# Altium project VCU.PrjPcb (part 1 of 2)
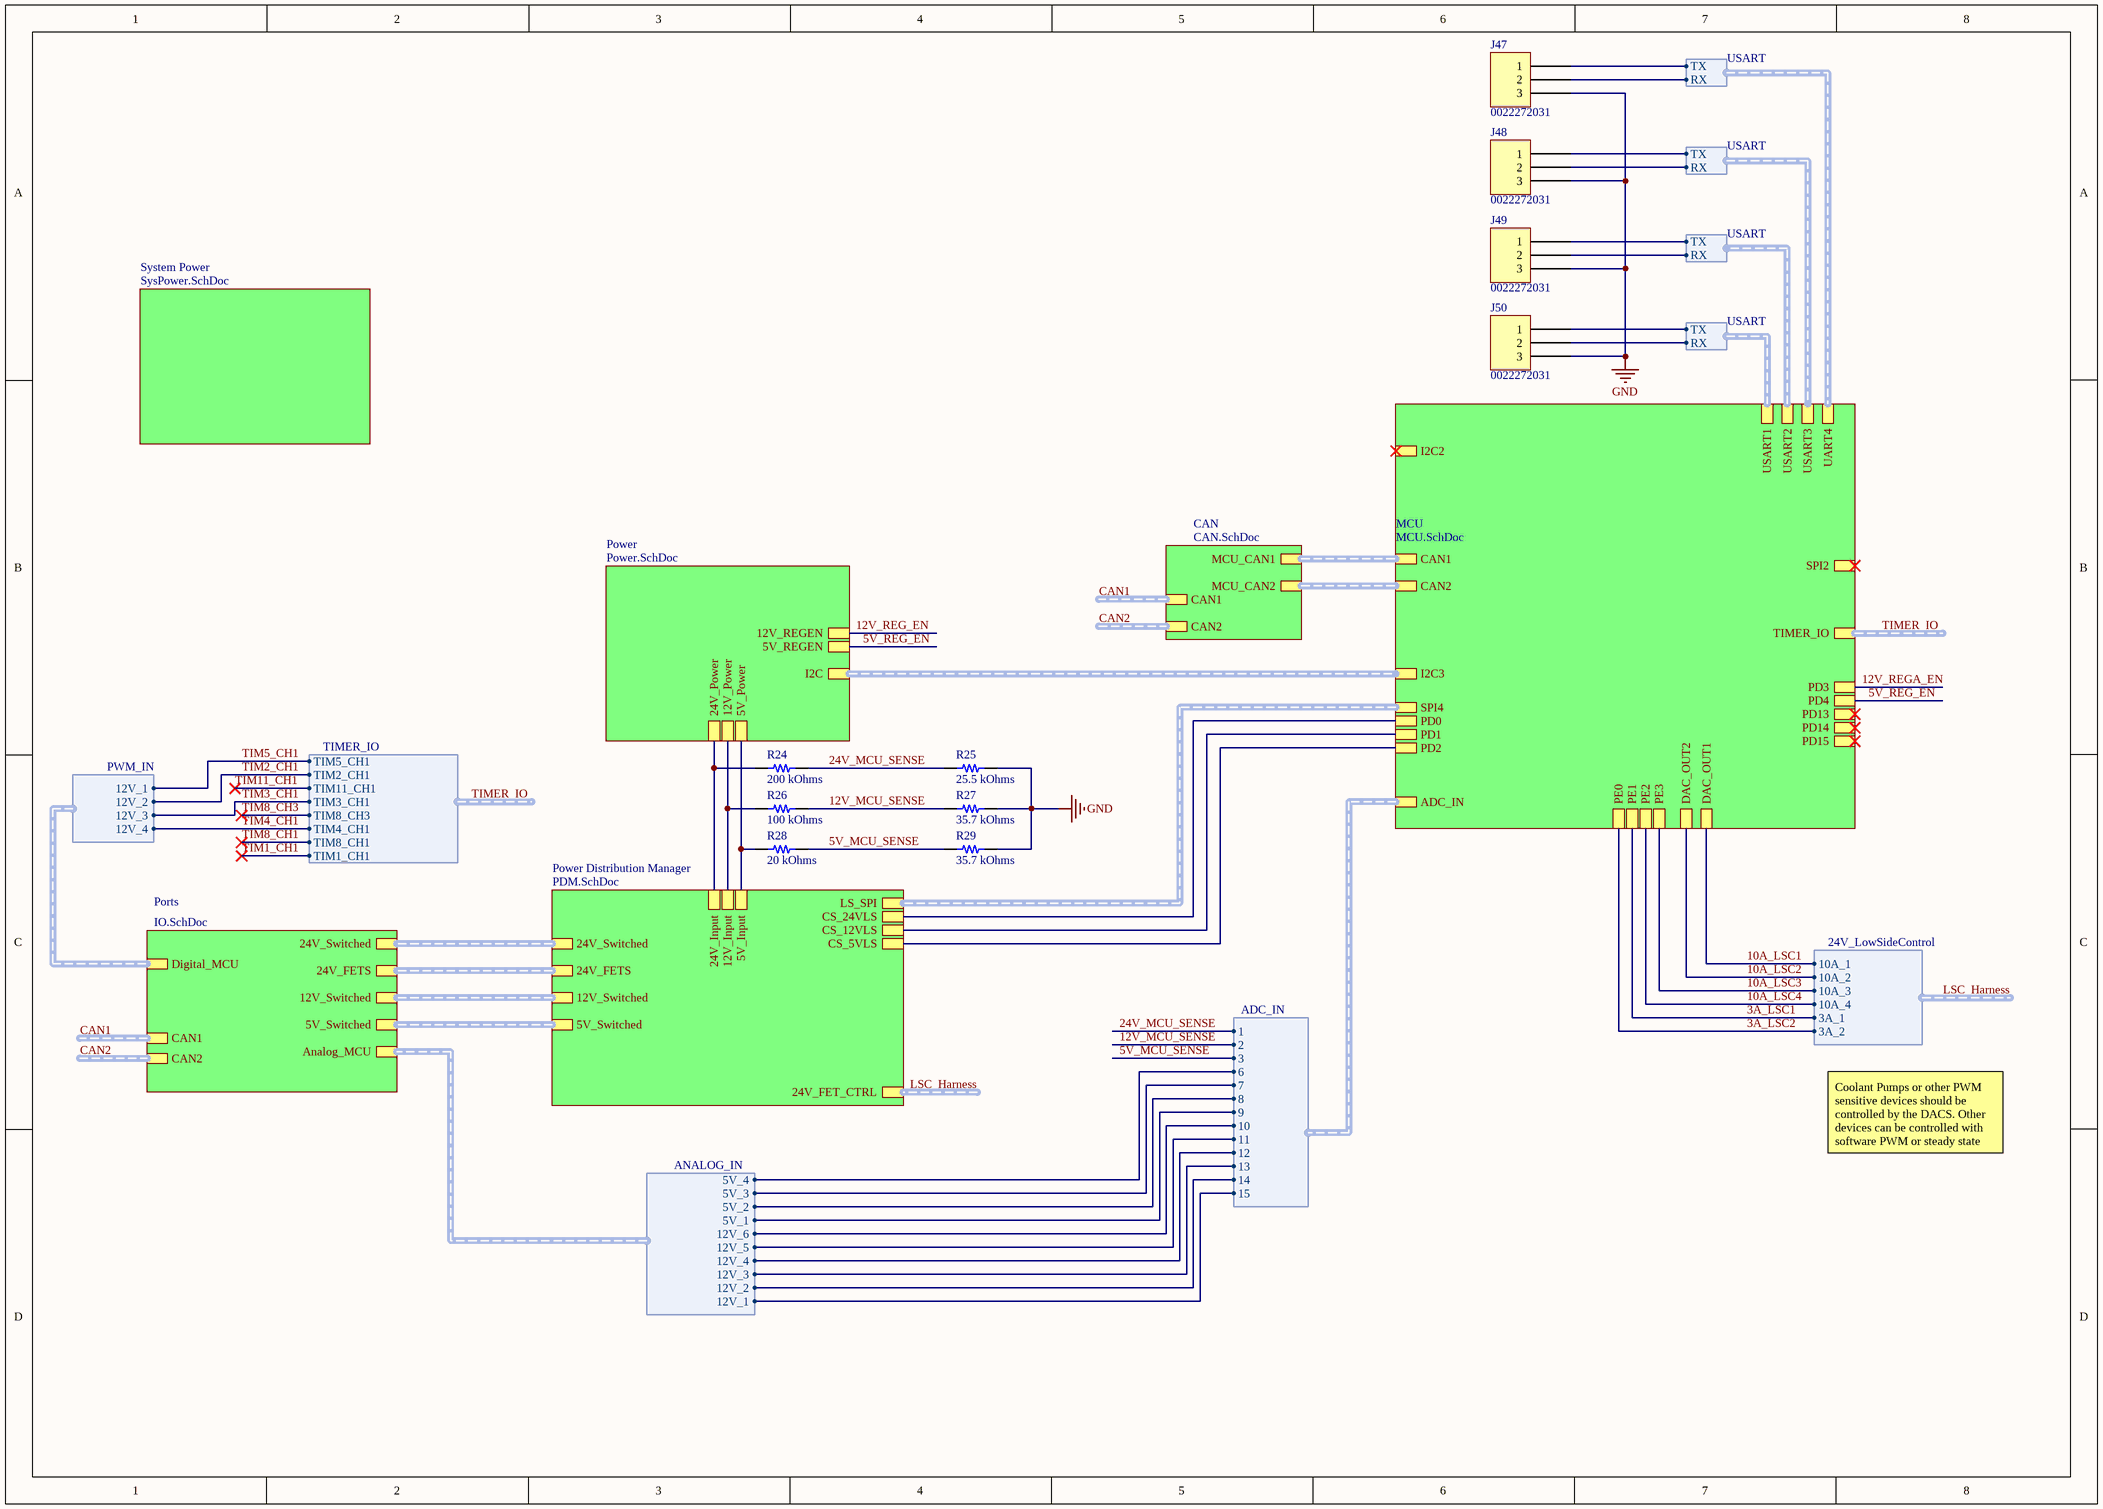
[diagram p0: TOP.SchDoc]
13 sheets, 149 parts. Net scope: hierarchical (ports join the sheet entries above them; power ports are global).
Sheets:
  TOP.SchDoc
    MCU = MCU.SchDoc
    CAN = CAN.SchDoc
    Ports = IO.SchDoc
      Analog Voltage Divs = AnalogIO.SchDoc
        Designator = 12V-3V3_Divider.SchDoc
        Designator = 12V-3V3_Divider.SchDoc
        Designator = 12V-3V3_Divider.SchDoc
        Designator = 12V-3V3_Divider.SchDoc
        Designator = 12V-3V3_Divider.SchDoc
        Designator = 12V-3V3_Divider.SchDoc
        Designator = 5V-3V3_Divider.SchDoc
        Designator = 5V-3V3_Divider.SchDoc
        Designator = 5V-3V3_Divider.SchDoc
        Designator = 5V-3V3_Divider.SchDoc
    Power Distribution Manager = PDM.SchDoc
      24V Load Switches = 24V_Load_Switches.SchDoc
        Designator = ShiftRegister.SchDoc
      Designator = 12V_Load_Switches.SchDoc
        Designator = ShiftRegister.SchDoc
      Designator = 5V_Load_Switches.SchDoc
        Designator = ShiftRegister.SchDoc
      Designator = 24V_FETS.SchDoc

## Sheet TOP.SchDoc: Q24 VCU
size A3; Author: JChisholm; DrawnBy: JChisholm; Organization: Queen's Formula SAE; Address1: 130 Stuart St, Kingston; Address2: Ontario; Address3: Canada; Address4: K7L 2V9; DocumentNumber: 1; Revision: 0; SheetNumber: 1; SheetTotal: 16

### Parts
J47  0022272031  [MOLEX KK 0022272031]
J48  0022272031  [MOLEX KK 0022272031]
J49  0022272031  [MOLEX KK 0022272031]
J50  0022272031  [MOLEX KK 0022272031]
R24  200 kOhms  [RES 0603_1608]
R25  25.5 kOhms  [RES 0603_1608]
R26  100 kOhms  [RES 0603_1608]
R27  35.7 kOhms  [RES 0603_1608]
R28  20 kOhms  [RES 0603_1608]
R29  35.7 kOhms  [RES 0603_1608]

### Sub-sheets
CAN = CAN.SchDoc: MCU_CAN1 (harness MCU_CAN), MCU_CAN2 (harness MCU_CAN), CAN1 (harness CAN), CAN2 (harness CAN)
MCU = MCU.SchDoc: TIMER_IO (harness TIMER_IO), PD0, PD1, PD2, PD3, PD4, ADC_IN (harness ADC_IN), UART4 (harness USART), USART2 (harness USART), SPI2 (harness SPI), USART1 (harness USART), CAN2 (harness MCU_CAN), CAN1 (harness MCU_CAN), USART3 (harness USART), SPI4 (harness SPI), I2C3 (harness I2C), DAC_OUT1, DAC_OUT2, PD13, PD14, PD15, PE0, PE1, PE2, PE3, I2C2 (harness I2C)
Ports = IO.SchDoc: CAN1 (harness CAN), CAN2 (harness CAN), 24V_Switched (harness 24V_LoadSwitches), 12V_Switched (harness 12V_LoadSwitches), 5V_Switched (harness 5V_LoadSwitches), 24V_FETS (harness 24V_FETS), Analog_MCU (harness ANALOG_IN), Digital_MCU (harness PWM_IN)
Power = Power.SchDoc (file not in this document): I2C (harness I2C), 12V_REGEN, 5V_REGEN, 24V_Power, 12V_Power, 5V_Power
Power Distribution Manager = PDM.SchDoc: 24V_Switched (harness 24V_LoadSwitches), 12V_Switched (harness 12V_LoadSwitches), 5V_Switched (harness 5V_LoadSwitches), 24V_FETS (harness 24V_FETS), 24V_FET_CTRL (harness 24V_LowSideControl), CS_24VLS, CS_12VLS, CS_5VLS, LS_SPI (harness SPI), 24V_Input, 12V_Input, 5V_Input
System Power = SysPower.SchDoc (file not in this document): no entries

### Harnesses
TIMER_IO: TIM5_CH1, TIM2_CH1, TIM11_CH1, TIM3_CH1, TIM8_CH3, TIM4_CH1, TIM8_CH1, TIM1_CH1
ANALOG_IN: 12V_1, 12V_2, 12V_3, 12V_4, 12V_5, 12V_6, 5V_1, 5V_2, 5V_3, 5V_4
ADC_IN: 1, 2, 3, 8, 9, 10, 11, 12, 13, 14, 15, 6, 7
24V_LowSideControl: 10A_1, 10A_2, 10A_3, 10A_4, 3A_1, 3A_2
PWM_IN: 12V_1, 12V_2, 12V_3, 12V_4
USART: TX, RX

### Nets
GND: J47.3 J48.3 J49.3 J50.3 R25.2 R27.2 R29.2
3A_LSC1: sheet MCU/PE1, sheet Power Distribution Manager/24V_FET_CTRL.3A_1
3A_LSC2: sheet MCU/PE0, sheet Power Distribution Manager/24V_FET_CTRL.3A_2
5V_MCU_SENSE: R28.2 R29.1 ; sheet MCU/ADC_IN.3
5V_REG_EN: sheet MCU/PD4, sheet Power/5V_REGEN
10A_LSC1: sheet MCU/DAC_OUT1, sheet Power Distribution Manager/24V_FET_CTRL.10A_1
10A_LSC2: sheet MCU/DAC_OUT2, sheet Power Distribution Manager/24V_FET_CTRL.10A_2
10A_LSC3: sheet MCU/PE3, sheet Power Distribution Manager/24V_FET_CTRL.10A_3
10A_LSC4: sheet MCU/PE2, sheet Power Distribution Manager/24V_FET_CTRL.10A_4
12V_MCU_SENSE: R26.2 R27.1 ; sheet MCU/ADC_IN.2
12V_REG_EN: sheet Power/12V_REGEN
24V_MCU_SENSE: R24.2 R25.1 ; sheet MCU/ADC_IN.1
ADC_IN6: sheet Ports/Analog_MCU.5V_4, sheet MCU/ADC_IN.6
ADC_IN7: sheet Ports/Analog_MCU.5V_3, sheet MCU/ADC_IN.7
ADC_IN8: sheet Ports/Analog_MCU.5V_2, sheet MCU/ADC_IN.8
ADC_IN9: sheet Ports/Analog_MCU.5V_1, sheet MCU/ADC_IN.9
ADC_IN10: sheet Ports/Analog_MCU.12V_6, sheet MCU/ADC_IN.10
ADC_IN11: sheet Ports/Analog_MCU.12V_5, sheet MCU/ADC_IN.11
ADC_IN12: sheet Ports/Analog_MCU.12V_4, sheet MCU/ADC_IN.12
ADC_IN13: sheet Ports/Analog_MCU.12V_3, sheet MCU/ADC_IN.13
ADC_IN14: sheet Ports/Analog_MCU.12V_2, sheet MCU/ADC_IN.14
ADC_IN15: sheet Ports/Analog_MCU.12V_1, sheet MCU/ADC_IN.15
TIM2_CH1: sheet MCU/TIMER_IO.TIM2_CH1, sheet Ports/Digital_MCU.12V_2
TIM3_CH1: sheet MCU/TIMER_IO.TIM3_CH1, sheet Ports/Digital_MCU.12V_3
TIM4_CH1: sheet MCU/TIMER_IO.TIM4_CH1, sheet Ports/Digital_MCU.12V_4
TIM5_CH1: sheet MCU/TIMER_IO.TIM5_CH1, sheet Ports/Digital_MCU.12V_1
TIM8_CH1: sheet MCU/TIMER_IO.TIM8_CH1
NetIC1_55: J48.1 ; sheet MCU/USART3.TX
NetIC1_56: J48.2 ; sheet MCU/USART3.RX
NetIC1_68: J50.1 ; sheet MCU/USART1.TX
NetIC1_69: J50.2 ; sheet MCU/USART1.RX
NetIC1_78: J47.1 ; sheet MCU/UART4.TX
NetIC1_79: J47.2 ; sheet MCU/UART4.RX
NetIC1_81: sheet MCU/PD0, sheet Power Distribution Manager/CS_24VLS
NetIC1_82: sheet MCU/PD1, sheet Power Distribution Manager/CS_12VLS
NetIC1_83: sheet MCU/PD2, sheet Power Distribution Manager/CS_5VLS
NetIC1_86: J49.1 ; sheet MCU/USART2.TX
NetIC1_87: J49.2 ; sheet MCU/USART2.RX
NetR24_1: R24.1 ; sheet Power Distribution Manager/24V_Input, sheet Power/24V_Power
NetR26_1: R26.1 ; sheet Power Distribution Manager/12V_Input, sheet Power/12V_Power
NetR28_1: R28.1 ; sheet Power Distribution Manager/5V_Input, sheet Power/5V_Power

### Buses and harness runs
harness CAN1 = sheet CAN/CAN1
harness CAN1 = sheet Ports/CAN1
harness CAN2 = sheet CAN/CAN2
harness CAN2 = sheet Ports/CAN2
harness LSC_Harness = sheet Power Distribution Manager/24V_FET_CTRL
harness sheet CAN/MCU_CAN1 = sheet MCU/CAN1
harness sheet CAN/MCU_CAN2 = sheet MCU/CAN2
harness sheet MCU/I2C3 = sheet Power/I2C
harness sheet MCU/SPI4 = sheet Power Distribution Manager/LS_SPI
harness sheet Ports/5V_Switched = sheet Power Distribution Manager/5V_Switched
harness sheet Ports/12V_Switched = sheet Power Distribution Manager/12V_Switched
harness sheet Ports/24V_FETS = sheet Power Distribution Manager/24V_FETS
harness sheet Ports/24V_Switched = sheet Power Distribution Manager/24V_Switched
harness TIMER_IO = sheet MCU/TIMER_IO

### Notes on the sheet
- Coolant Pumps or other PWM sensitive devices should be controlled by the DACS. Other devices can be controlled with software PWM or steady state
- Title
- Size:
- Date:
- A4
- Number:
- Time:
- Revision:
- Sheet
- of
- File:

### Library data of the parts
J47-J50 = 0022272031: CONN HEADER VERT 3POS 2.54MM; Part Number: 0022272031
R24 = AC0603FR-07200KL: RES SMD 200K OHM 1% 1/10W 0603; Manufacturer: Yageo; Power (Watts): 0.1W, 1/10W; Temperature Coefficient: ±100ppm/°C; Part Number: AC0603FR-07200KL; Value: 200 kOhms; ComponentLink1Description: Datasheet; ComponentLink1URL: https://www.yageo.com/upload/media/product/productsearch/datasheet/rchip/PYu-AC_51_RoHS_L_7.pdf; ComponentLink2Description: DigiKey Link; ComponentLink2URL: https://www.digikey.com/en/products/detail/yageo/AC0603FR-07200KL/5895902; Composition: Thick Film; Device Package: 0603 (1608 Metric); Features: Automotive AEC-Q200, Moisture Resistant; Height - Seated (Max): 0.022" (0.55mm); LastUpdated: 12/20/2023 8:38:29 PM; Lifecycle Status: Active; Minimum Order: 1; Number of Terminations: 2; Operating Temperature: -55°C ~ 155°C; Package / Case: 0603 (1608 Metric); Packaging: CutTape; PartId: 15822; Part Status: Active; Price: 0.01; Ratings: AEC-Q200; Resistance: 200 kOhms; Series: AC; Size / Dimension: 0.063" L x 0.031" W (1.60mm x 0.80mm); Supplier 1: DigiKey; Supplier Part Number 1: YAG3575CT-ND; Supplier Device Package: 0603; Tolerance: ±1%
R25 = CPF0603B25K5E1: RES SMD 25.5KOHM 0.1% 1/16W 0603; Manufacturer: TE Connectivity Passive Product; Power (Watts): 0.063W, 1/16W; Temperature Coefficient: ±25ppm/°C; Part Number: CPF0603B25K5E1; Value: 25.5 kOhms; ComponentLink1Description: Datasheet; ComponentLink1URL: https://www.te.com/commerce/DocumentDelivery/DDEController?Action=srchrtrv&DocNm=1773200&DocType=DS&DocLang=English; ComponentLink2Description: DigiKey Link; ComponentLink2URL: https://www.digikey.com/en/products/detail/te-connectivity-passive-product/CPF0603B25K5E1/2382925; Composition: Thin Film; Device Package: 0603 (1608 Metric); Height - Seated (Max): 0.022" (0.55mm); LastUpdated: 12/20/2023 8:36:34 PM; Lifecycle Status: Active; Minimum Order: 1; Number of Terminations: 2; Operating Temperature: -55°C ~ 155°C; Package / Case: 0603 (1608 Metric); Packaging: TapeAndReel; PartId: 75127; Part Status: Active; Price: 0.12; Resistance: 25.5 kOhms; Series: CPF, Neohm; Size / Dimension: 0.061" L x 0.031" W (1.55mm x 0.80mm); Supplier 1: DigiKey; Supplier Part Number 1: 1712-CPF0603B25K5E1CT-ND; Supplier Device Package: 0603; Tolerance: ±0.1%
R26 = AA0603FR-07100KL: RES SMD 100K OHM 1% 1/10W 0603; Manufacturer: Yageo; Power (Watts): 0.1W, 1/10W; Temperature Coefficient: ±150ppm/°C; Part Number: AA0603FR-07100KL; Value: 100 kOhms; ComponentLink1Description: Datasheet; ComponentLink1URL: https://www.yageo.com/upload/media/product/productsearch/datasheet/rchip/PYu-AA_51_RoHS_L_3.pdf; ComponentLink2Description: DigiKey Link; ComponentLink2URL: https://www.digikey.com/en/products/detail/yageo/AA0603FR-07100KL/5888687; Composition: Thick Film; Device Package: 0603 (1608 Metric); Features: Anti-Sulfur, Automotive AEC-Q200, Moisture Resistant; Height - Seated (Max): 0.022" (0.55mm); LastUpdated: 12/20/2023 8:36:28 PM; Lifecycle Status: Active; Minimum Order: 1; Number of Terminations: 2; Operating Temperature: -55°C ~ 155°C; Package / Case: 0603 (1608 Metric); Packaging: TapeAndReel; PartId: 78895; Price: 0.01; Ratings: AEC-Q200; Resistance: 100 kOhms; Series: AA; Size / Dimension: 0.063" L x 0.031" W (1.60mm x 0.80mm); Supplier 1: DigiKey; Supplier Part Number 1: 13-AA0603FR-07100KLCT-ND; Supplier Device Package: 0603; Tolerance: ±1%
R27 R29 = RT0603BRD0735K7L: RES SMD 35.7KOHM 0.1% 1/10W 0603; Manufacturer: Yageo; Power (Watts): 0.1W, 1/10W; Temperature Coefficient: ±25ppm/°C; Part Number: RT0603BRD0735K7L; Value: 35.7 kOhms; ComponentLink1Description: Datasheet; ComponentLink1URL: https://www.yageo.com/upload/media/product/productsearch/datasheet/rchip/PYu-RT_1-to-0.01_RoHS_L_11.pdf; ComponentLink2Description: DigiKey Link; ComponentLink2URL: https://www.digikey.com/en/products/detail/yageo/RT0603BRD0735K7L/1072480; Composition: Thin Film; Device Package: 0603 (1608 Metric); Height - Seated (Max): 0.022" (0.55mm); LastUpdated: 12/20/2023 8:38:52 PM; Lifecycle Status: Active; Minimum Order: 1; Number of Terminations: 2; Operating Temperature: -55°C ~ 155°C; Package / Case: 0603 (1608 Metric); Packaging: TapeAndReel; PartId: 9286; Part Status: Active; Price: 0.03; Resistance: 35.7 kOhms; Series: RT; Size / Dimension: 0.063" L x 0.031" W (1.60mm x 0.80mm); Supplier 1: DigiKey; Supplier Part Number 1: YAG1642CT-ND; Supplier Device Package: 0603; Tolerance: ±0.1%
R28 = AC0603FR-0720KL: RES SMD 20K OHM 1% 1/10W 0603; Manufacturer: Yageo; Power (Watts): 0.1W, 1/10W; Temperature Coefficient: ±100ppm/°C; Part Number: AC0603FR-0720KL; Value: 20 kOhms; ComponentLink1Description: Datasheet; ComponentLink1URL: https://www.yageo.com/upload/media/product/productsearch/datasheet/rchip/PYu-AC_51_RoHS_L_7.pdf; ComponentLink2Description: DigiKey Link; ComponentLink2URL: https://www.digikey.com/en/products/detail/yageo/AC0603FR-0720KL/5895907; Composition: Thick Film; Device Package: 0603 (1608 Metric); Features: Automotive AEC-Q200, Moisture Resistant; Height - Seated (Max): 0.022" (0.55mm); LastUpdated: 12/20/2023 8:38:24 PM; Lifecycle Status: Active; Minimum Order: 1; Number of Terminations: 2; Operating Temperature: -55°C ~ 155°C; Package / Case: 0603 (1608 Metric); Packaging: CutTape; PartId: 17364; Part Status: Active; Price: 0.01; Ratings: AEC-Q200; Resistance: 20 kOhms; Series: AC; Size / Dimension: 0.063" L x 0.031" W (1.60mm x 0.80mm); Supplier 1: DigiKey; Supplier Part Number 1: YAG3577CT-ND; Supplier Device Package: 0603; Tolerance: ±1%

## Sheet MCU.SchDoc: =DocumentName
size A3; Organization: Queen's Formula SAE; Address1: 130 Stuart St, Kingston; Address2: Ontario; Address3: Canada; Address4: K7L 2V9; DocumentNumber: 1; Revision: 0; SheetNumber: 2; SheetTotal: 19
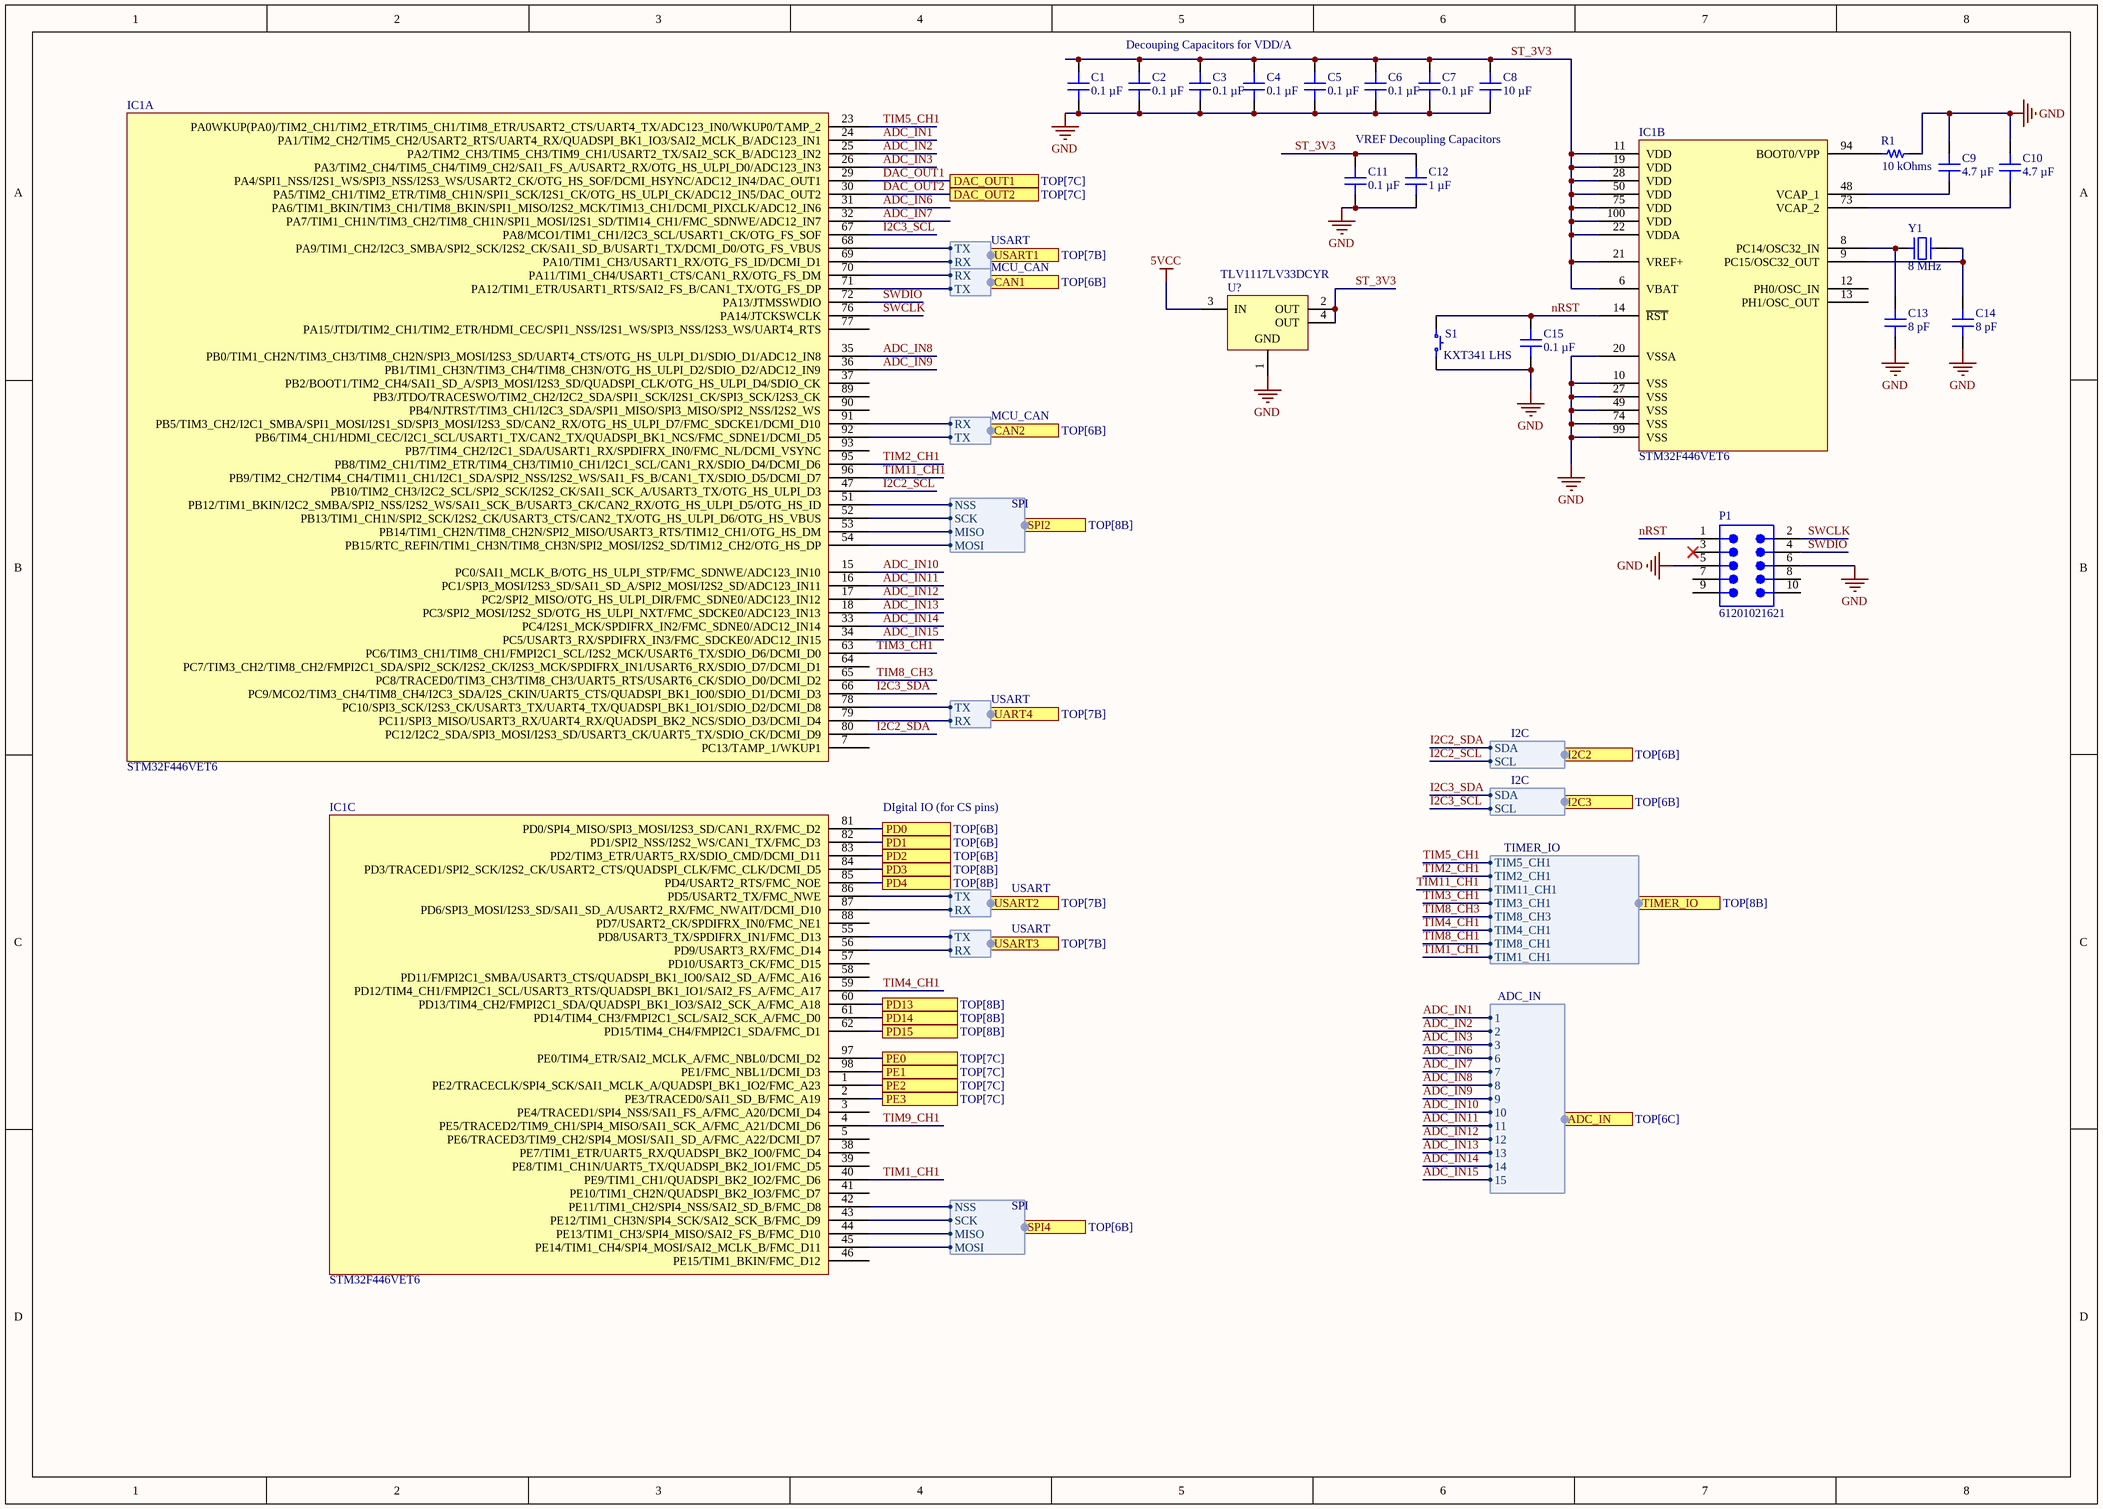
[diagram p1: MCU.SchDoc]

### Parts
(Parts that share a designator on the sheet are numbered #1, #2 ... from top to bottom, then left to right.)
C1  0.1 µF  [CAP 0603_1608]
C2  0.1 µF  [CAP 0603_1608]
C3  0.1 µF  [CAP 0603_1608]
C4  0.1 µF  [CAP 0603_1608]
C5  0.1 µF  [CAP 0603_1608]
C6  0.1 µF  [CAP 0603_1608]
C7  0.1 µF  [CAP 0603_1608]
C8  10 µF  [CAP 0603_1608]
C9  4.7 µF  [CAP 0603_1608]
C10  4.7 µF  [CAP 0603_1608]
C11  0.1 µF  [CAP 0603_1608]
C12  1 µF  [CAP 0603_1608]
C13  8 pF  [CAP 0603_1608]
C14  8 pF  [CAP 0603_1608]
C15  0.1 µF  [CAP 0603_1608]
IC1  STM32F446VET6  [ST LQFP-100 14X14MM]  (parts A,B,C of 3)
P1  61201021621  [61201021621]
R1  10 kOhms  [RES 0603_1608]
S1  KXT341 LHS  [C&K KXT3]
U?#1  TLV1117LV33DCYR  [DCY0004A_N]
Y1  8 MHz  [ABRACON ABLS]

### Ports
ADC_IN (harness ADC_IN, see TOP[6C]), CAN1 (harness MCU_CAN, see TOP[6B]), CAN2 (harness MCU_CAN, see TOP[6B]), DAC_OUT1 (see TOP[7C]), DAC_OUT2 (see TOP[7C]), I2C2 (harness I2C, see TOP[6B]), I2C3 (harness I2C, see TOP[6B]), PD0 (see TOP[6B]), PD1 (see TOP[6B]), PD2 (see TOP[6B]), PD3 (see TOP[8B]), PD4 (see TOP[8B]), PD13 (see TOP[8B]), PD14 (see TOP[8B]), PD15 (see TOP[8B]), PE0 (see TOP[7C]), PE1 (see TOP[7C]), PE2 (see TOP[7C]), PE3 (see TOP[7C]), SPI2 (harness SPI, see TOP[8B]), SPI4 (harness SPI, see TOP[6B]), TIMER_IO (harness TIMER_IO, see TOP[8B]), UART4 (harness USART, see TOP[7B]), USART1 (harness USART, see TOP[7B]), USART2 (harness USART, see TOP[7B]), USART3 (harness USART, see TOP[7B])

### Harnesses
USART: TX, RX
SPI: NSS, SCK, MISO, MOSI
MCU_CAN: TX, RX
TIMER_IO: TIM5_CH1, TIM2_CH1, TIM11_CH1, TIM3_CH1, TIM8_CH3, TIM4_CH1, TIM8_CH1, TIM1_CH1
I2C: SDA, SCL
ADC_IN: 1, 2, 3, 8, 9, 10, 11, 12, 13, 14, 15, 6, 7

### Nets
5VCC: U?#1.3(IN)
GND: C1.1 C2.1 C3.1 C4.1 C5.1 C6.1 C7.1 C8.1 C9.2 C10.2 C11.1 C12.1 C13.1 C14.1 C15.1 IC1.10(VSS) IC1.20(VSSA) IC1.27(VSS) IC1.49(VSS) IC1.74(VSS) IC1.99(VSS) P1.5 P1.6 R1.2 S1.2 U?#1.1(GND)
3A_LSC1: IC1.98(PE1/FMC_NBL1/DCMI_D3) ; port PE1
3A_LSC2: IC1.97(PE0/TIM4_ETR/SAI2_MCLK_A/FMC_NBL0/DCMI_D2) ; port PE0
5V_REG_EN: IC1.85(PD4/USART2_RTS/FMC_NOE) ; port PD4
10A_LSC3: IC1.2(PE3/TRACED0/SAI1_SD_B/FMC_A19) ; port PE3
10A_LSC4: IC1.1(PE2/TRACECLK/SPI4_SCK/SAI1_MCLK_A/QUADSPI_BK1_IO2/FMC_A23) ; port PE2
12V_REGA_EN: IC1.84(PD3/TRACED1/SPI2_SCK/I2S2_CK/USART2_CTS/QUADSPI_CLK/FMC_CLK/DCMI_D5) ; port PD3
ADC_IN1: IC1.24(PA1/TIM2_CH2/TIM5_CH2/USART2_RTS/UART4_RX/QUADSPI_BK1_IO3/SAI2_MCLK_B/ADC123_IN1) ; port ADC_IN.1  [project net 24V_MCU_SENSE]
ADC_IN2: IC1.25(PA2/TIM2_CH3/TIM5_CH3/TIM9_CH1/USART2_TX/SAI2_SCK_B/ADC123_IN2) ; port ADC_IN.2  [project net 12V_MCU_SENSE]
ADC_IN3: IC1.26(PA3/TIM2_CH4/TIM5_CH4/TIM9_CH2/SAI1_FS_A/USART2_RX/OTG_HS_ULPI_D0/ADC123_IN3) ; port ADC_IN.3  [project net 5V_MCU_SENSE]
ADC_IN6: IC1.31(PA6/TIM1_BKIN/TIM3_CH1/TIM8_BKIN/SPI1_MISO/I2S2_MCK/TIM13_CH1/DCMI_PIXCLK/ADC12_IN6) ; port ADC_IN.6
ADC_IN7: IC1.32(PA7/TIM1_CH1N/TIM3_CH2/TIM8_CH1N/SPI1_MOSI/I2S1_SD/TIM14_CH1/FMC_SDNWE/ADC12_IN7) ; port ADC_IN.7
ADC_IN8: IC1.35(PB0/TIM1_CH2N/TIM3_CH3/TIM8_CH2N/SPI3_MOSI/I2S3_SD/UART4_CTS/OTG_HS_ULPI_D1/SDIO_D1/ADC12_IN8) ; port ADC_IN.8
ADC_IN9: IC1.36(PB1/TIM1_CH3N/TIM3_CH4/TIM8_CH3N/OTG_HS_ULPI_D2/SDIO_D2/ADC12_IN9) ; port ADC_IN.9
ADC_IN10: IC1.15(PC0/SAI1_MCLK_B/OTG_HS_ULPI_STP/FMC_SDNWE/ADC123_IN10) ; port ADC_IN.10
ADC_IN11: IC1.16(PC1/SPI3_MOSI/I2S3_SD/SAI1_SD_A/SPI2_MOSI/I2S2_SD/ADC123_IN11) ; port ADC_IN.11
ADC_IN12: IC1.17(PC2/SPI2_MISO/OTG_HS_ULPI_DIR/FMC_SDNE0/ADC123_IN12) ; port ADC_IN.12
ADC_IN13: IC1.18(PC3/SPI2_MOSI/I2S2_SD/OTG_HS_ULPI_NXT/FMC_SDCKE0/ADC123_IN13) ; port ADC_IN.13
ADC_IN14: IC1.33(PC4/I2S1_MCK/SPDIFRX_IN2/FMC_SDNE0/ADC12_IN14) ; port ADC_IN.14
ADC_IN15: IC1.34(PC5/USART3_RX/SPDIFRX_IN3/FMC_SDCKE0/ADC12_IN15) ; port ADC_IN.15
DAC_OUT1: IC1.29(PA4/SPI1_NSS/I2S1_WS/SPI3_NSS/I2S3_WS/USART2_CK/OTG_HS_SOF/DCMI_HSYNC/ADC12_IN4/DAC_OUT1) ; port DAC_OUT1  [project net 10A_LSC1]
DAC_OUT2: IC1.30(PA5/TIM2_CH1/TIM2_ETR/TIM8_CH1N/SPI1_SCK/I2S1_CK/OTG_HS_ULPI_CK/ADC12_IN5/DAC_OUT2) ; port DAC_OUT2  [project net 10A_LSC2]
I2C2_SCL: IC1.47(PB10/TIM2_CH3/I2C2_SCL/SPI2_SCK/I2S2_CK/SAI1_SCK_A/USART3_TX/OTG_HS_ULPI_D3) ; port I2C2.SCL
I2C2_SDA: IC1.80(PC12/I2C2_SDA/SPI3_MOSI/I2S3_SD/USART3_CK/UART5_TX/SDIO_CK/DCMI_D9) ; port I2C2.SDA
I2C3_SCL: IC1.67(PA8/MCO1/TIM1_CH1/I2C3_SCL/USART1_CK/OTG_FS_SOF) ; port I2C3.SCL
I2C3_SDA: IC1.66(PC9/MCO2/TIM3_CH4/TIM8_CH4/I2C3_SDA/I2S_CKIN/UART5_CTS/QUADSPI_BK1_IO0/SDIO_D1/DCMI_D3) ; port I2C3.SDA
nRST: C15.2 IC1.14(~{RST}) P1.1 S1.1
ST_3V3: C1.2 C2.2 C3.2 C4.2 C5.2 C6.2 C7.2 C8.2 C11.2 C12.2 IC1.6(VBAT) IC1.11(VDD) IC1.19(VDD) IC1.21(VREF+) IC1.22(VDDA) IC1.28(VDD) IC1.50(VDD) IC1.75(VDD) IC1.100(VDD) U?#1.2(OUT) U?#1.4(OUT)
SWCLK: IC1.76(PA14/JTCKSWCLK) P1.2
SWDIO: IC1.72(PA13/JTMSSWDIO) P1.4
TIM1_CH1: IC1.40(PE9/TIM1_CH1/QUADSPI_BK2_IO2/FMC_D6) ; port TIMER_IO.TIM1_CH1
TIM2_CH1: IC1.95(PB8/TIM2_CH1/TIM2_ETR/TIM4_CH3/TIM10_CH1/I2C1_SCL/CAN1_RX/SDIO_D4/DCMI_D6) ; port TIMER_IO.TIM2_CH1
TIM3_CH1: IC1.63(PC6/TIM3_CH1/TIM8_CH1/FMPI2C1_SCL/I2S2_MCK/USART6_TX/SDIO_D6/DCMI_D0) ; port TIMER_IO.TIM3_CH1
TIM4_CH1: IC1.59(PD12/TIM4_CH1/FMPI2C1_SCL/USART3_RTS/QUADSPI_BK1_IO1/SAI2_FS_A/FMC_A17) ; port TIMER_IO.TIM4_CH1
TIM5_CH1: IC1.23(PA0WKUP(PA0)/TIM2_CH1/TIM2_ETR/TIM5_CH1/TIM8_ETR/USART2_CTS/UART4_TX/ADC123_IN0/WKUP0/TAMP_2) ; port TIMER_IO.TIM5_CH1
TIM8_CH1: port TIMER_IO.TIM8_CH1
TIM8_CH3: IC1.65(PC8/TRACED0/TIM3_CH3/TIM8_CH3/UART5_RTS/USART6_CK/SDIO_D0/DCMI_D2) ; port TIMER_IO.TIM8_CH3
TIM9_CH1: IC1.4(PE5/TRACED2/TIM9_CH1/SPI4_MISO/SAI1_SCK_A/FMC_A21/DCMI_D6)
TIM11_CH1: IC1.96(PB9/TIM2_CH2/TIM4_CH4/TIM11_CH1/I2C1_SDA/SPI2_NSS/I2S2_WS/SAI1_FS_B/CAN1_TX/SDIO_D5/DCMI_D7) ; port TIMER_IO.TIM11_CH1
NetC9_1: C9.1 IC1.48(VCAP_1)
NetC10_1: C10.1 IC1.73(VCAP_2)
NetC13_2: C13.2 IC1.8(PC14/OSC32_IN) Y1.2
NetC14_2: C14.2 IC1.9(PC15/OSC32_OUT) Y1.1
NetIC1_42: IC1.42(PE11/TIM1_CH2/SPI4_NSS/SAI2_SD_B/FMC_D8) ; port SPI4.NSS
NetIC1_43: IC1.43(PE12/TIM1_CH3N/SPI4_SCK/SAI2_SCK_B/FMC_D9) ; port SPI4.SCK
NetIC1_44: IC1.44(PE13/TIM1_CH3/SPI4_MISO/SAI2_FS_B/FMC_D10) ; port SPI4.MISO
NetIC1_45: IC1.45(PE14/TIM1_CH4/SPI4_MOSI/SAI2_MCLK_B/FMC_D11) ; port SPI4.MOSI
NetIC1_51: IC1.51(PB12/TIM1_BKIN/I2C2_SMBA/SPI2_NSS/I2S2_WS/SAI1_SCK_B/USART3_CK/CAN2_RX/OTG_HS_ULPI_D5/OTG_HS_ID) ; port SPI2.NSS
NetIC1_52: IC1.52(PB13/TIM1_CH1N/SPI2_SCK/I2S2_CK/USART3_CTS/CAN2_TX/OTG_HS_ULPI_D6/OTG_HS_VBUS) ; port SPI2.SCK
NetIC1_53: IC1.53(PB14/TIM1_CH2N/TIM8_CH2N/SPI2_MISO/USART3_RTS/TIM12_CH1/OTG_HS_DM) ; port SPI2.MISO
NetIC1_54: IC1.54(PB15/RTC_REFIN/TIM1_CH3N/TIM8_CH3N/SPI2_MOSI/I2S2_SD/TIM12_CH2/OTG_HS_DP) ; port SPI2.MOSI
NetIC1_55: IC1.55(PD8/USART3_TX/SPDIFRX_IN1/FMC_D13) ; port USART3.TX
NetIC1_56: IC1.56(PD9/USART3_RX/FMC_D14) ; port USART3.RX
NetIC1_60: IC1.60(PD13/TIM4_CH2/FMPI2C1_SDA/QUADSPI_BK1_IO3/SAI2_SCK_A/FMC_A18) ; port PD13
NetIC1_61: IC1.61(PD14/TIM4_CH3/FMPI2C1_SCL/SAI2_SCK_A/FMC_D0) ; port PD14
NetIC1_62: IC1.62(PD15/TIM4_CH4/FMPI2C1_SDA/FMC_D1) ; port PD15
NetIC1_68: IC1.68(PA9/TIM1_CH2/I2C3_SMBA/SPI2_SCK/I2S2_CK/SAI1_SD_B/USART1_TX/DCMI_D0/OTG_FS_VBUS) ; port USART1.TX
NetIC1_69: IC1.69(PA10/TIM1_CH3/USART1_RX/OTG_FS_ID/DCMI_D1) ; port USART1.RX
NetIC1_70: IC1.70(PA11/TIM1_CH4/USART1_CTS/CAN1_RX/OTG_FS_DM) ; port CAN1.RX
NetIC1_71: IC1.71(PA12/TIM1_ETR/USART1_RTS/SAI2_FS_B/CAN1_TX/OTG_FS_DP) ; port CAN1.TX
NetIC1_78: IC1.78(PC10/SPI3_SCK/I2S3_CK/USART3_TX/UART4_TX/QUADSPI_BK1_IO1/SDIO_D2/DCMI_D8) ; port UART4.TX
NetIC1_79: IC1.79(PC11/SPI3_MISO/USART3_RX/UART4_RX/QUADSPI_BK2_NCS/SDIO_D3/DCMI_D4) ; port UART4.RX
NetIC1_81: IC1.81(PD0/SPI4_MISO/SPI3_MOSI/I2S3_SD/CAN1_RX/FMC_D2) ; port PD0
NetIC1_82: IC1.82(PD1/SPI2_NSS/I2S2_WS/CAN1_TX/FMC_D3) ; port PD1
NetIC1_83: IC1.83(PD2/TIM3_ETR/UART5_RX/SDIO_CMD/DCMI_D11) ; port PD2
NetIC1_86: IC1.86(PD5/USART2_TX/FMC_NWE) ; port USART2.TX
NetIC1_87: IC1.87(PD6/SPI3_MOSI/I2S3_SD/SAI1_SD_A/USART2_RX/FMC_NWAIT/DCMI_D10) ; port USART2.RX
NetIC1_91: IC1.91(PB5/TIM3_CH2/I2C1_SMBA/SPI1_MOSI/I2S1_SD/SPI3_MOSI/I2S3_SD/CAN2_RX/OTG_HS_ULPI_D7/FMC_SDCKE1/DCMI_D10) ; port CAN2.RX
NetIC1_92: IC1.92(PB6/TIM4_CH1/HDMI_CEC/I2C1_SCL/USART1_TX/CAN2_TX/QUADSPI_BK1_NCS/FMC_SDNE1/DCMI_D5) ; port CAN2.TX
NetIC1_94: IC1.94(BOOT0/VPP) R1.1

Not connected (* = marked no-connect by the designer): IC1 3(PE4/TRACED1/SPI4_NSS/SAI1_FS_A/FMC_A20/DCMI_D4) 5(PE6/TRACED3/TIM9_CH2/SPI4_MOSI/SAI1_SD_A/FMC_A22/DCMI_D7) 7(PC13/TAMP_1/WKUP1) 12(PH0/OSC_IN) 13(PH1/OSC_OUT) 37(PB2/BOOT1/TIM2_CH4/SAI1_SD_A/SPI3_MOSI/I2S3_SD/QUADSPI_CLK/OTG_HS_ULPI_D4/SDIO_CK) 38(PE7/TIM1_ETR/UART5_RX/QUADSPI_BK2_IO0/FMC_D4) 39(PE8/TIM1_CH1N/UART5_TX/QUADSPI_BK2_IO1/FMC_D5) 41(PE10/TIM1_CH2N/QUADSPI_BK2_IO3/FMC_D7) 46(PE15/TIM1_BKIN/FMC_D12) 57(PD10/USART3_CK/FMC_D15) 58(PD11/FMPI2C1_SMBA/USART3_CTS/QUADSPI_BK1_IO0/SAI2_SD_A/FMC_A16) 64(PC7/TIM3_CH2/TIM8_CH2/FMPI2C1_SDA/SPI2_SCK/I2S2_CK/I2S3_MCK/SPDIFRX_IN1/USART6_RX/SDIO_D7/DCMI_D1) 77(PA15/JTDI/TIM2_CH1/TIM2_ETR/HDMI_CEC/SPI1_NSS/I2S1_WS/SPI3_NSS/I2S3_WS/UART4_RTS) 88(PD7/USART2_CK/SPDIFRX_IN0/FMC_NE1) 89(PB3/JTDO/TRACESWO/TIM2_CH2/I2C2_SDA/SPI1_SCK/I2S1_CK/SPI3_SCK/I2S3_CK) 90(PB4/NJTRST/TIM3_CH1/I2C3_SDA/SPI1_MISO/SPI3_MISO/SPI2_NSS/I2S2_WS) 93(PB7/TIM4_CH2/I2C1_SDA/USART1_RX/SPDIFRX_IN0/FMC_NL/DCMI_VSYNC); P1 3* 7 8 9 10

### Notes on the sheet
- Decouping Capacitors for VDD/A
- VREF Decoupling Capacitors
- DIgital IO (for CS pins)
- Title
- Size:
- Date:
- A4
- Number:
- Time:
- Revision:
- Sheet
- of
- File:

### Library data of the parts
C1-C7 C11 C15 = GMC10X7R104K25NT: CAP0603 X7R .1UF 10% 25V; manufacturer: Cal-Chip Electronics, Inc.; Part Number: GMC10X7R104K25NT; Value: 0.1 µF; Applications: General Purpose; Capacitance: 0.1 µF; componentlink1description: Datasheet; componentlink1url: https://88ce57.p3cdn1.secureserver.net/wp-content/uploads/2023/01/gmc_series-2.pdf; componentlink2description: DigiKey Link; componentlink2url: https://www.digikey.com/en/products/detail/cal-chip-electronics-inc/GMC10X7R104K25NT/19910724; Device Package: 0603 (1608 Metric); lastupdated: 12/17/2023 8:07:44 PM; Lifecycle Status: Active; Minimum Order: 1; Mounting Type: Surface Mount, MLCC; Operating Temperature: -55°C ~ 125°C; Package / Case: 0603 (1608 Metric); packaging: TapeAndReel; partid: 56631; price: 0.01; series: GMC; Size / Dimension: 0.063" L x 0.031" W (1.60mm x 0.80mm); Supplier 1: DigiKey; Supplier Part Number 1: 4713-GMC10X7R104K25NTCT-ND; Temperature Coefficient: X7R; Thickness (Max): 0.035" (0.90mm); Tolerance: ±10%; Voltage - Rated: 25V
C8 = CM105X5R106K16AT: 0603 X5R 10UF10% 16V; manufacturer: KYOCERA AVX; Tolerance: ±10%; Part Number: CM105X5R106K16AT; Value: 10 µF; Applications: General Purpose; Capacitance: 10 µF; componentlink1description: Datasheet; componentlink1url: https://ele.kyocera.com/assets/products/capacitor/CM_Series_e.pdf; componentlink2description: DigiKey Link; componentlink2url: https://www.digikey.com/en/products/detail/kyocera-avx/CM105X5R106K16AT/17866311; Device Package: 0603 (1608 Metric); lastupdated: 12/17/2023 8:07:58 PM; Lifecycle Status: Active; Minimum Order: 1; Mounting Type: Surface Mount, MLCC; Operating Temperature: -55°C ~ 85°C; Package / Case: 0603 (1608 Metric); packaging: TapeAndReel; partid: 55416; Part Status: Active; price: 0.03; series: CM; Size / Dimension: 0.063" L x 0.031" W (1.60mm x 0.80mm); Supplier 1: DigiKey; Supplier Part Number 1: 478-CM105X5R106K16ATCT-ND; Temperature Coefficient: X5R; Thickness (Max): 0.039" (1.00mm); Voltage - Rated: 16V
C9 C10 = CM105X6S475K16AT: 0603 X6S 4.7UF10% 16V; manufacturer: KYOCERA AVX; Tolerance: ±10%; Part Number: CM105X6S475K16AT; Value: 4.7 µF; Applications: General Purpose; Capacitance: 4.7 µF; componentlink1description: Datasheet; componentlink1url: https://ele.kyocera.com/assets/products/capacitor/CM_Series_e.pdf; componentlink2description: DigiKey Link; componentlink2url: https://www.digikey.com/en/products/detail/kyocera-avx/CM105X6S475K16AT/17866329; Device Package: 0603 (1608 Metric); lastupdated: 12/17/2023 8:08:01 PM; Lifecycle Status: Active; Minimum Order: 1; Mounting Type: Surface Mount, MLCC; Operating Temperature: -55°C ~ 105°C; Package / Case: 0603 (1608 Metric); packaging: TapeAndReel; partid: 54723; Part Status: Active; price: 0.06; series: CM; Size / Dimension: 0.063" L x 0.031" W (1.60mm x 0.80mm); Supplier 1: DigiKey; Supplier Part Number 1: 478-CM105X6S475K16ATCT-ND; Temperature Coefficient: X6S; Thickness (Max): 0.039" (1.00mm); Voltage - Rated: 16V
C12 = GMC10X7R105K50NT: CAP0603 X7R 1UF 10% 50V; manufacturer: Cal-Chip Electronics, Inc.; Part Number: GMC10X7R105K50NT; Value: 1 µF; Applications: General Purpose; Capacitance: 1 µF; componentlink1description: Datasheet; componentlink1url: https://88ce57.p3cdn1.secureserver.net/wp-content/uploads/2023/01/gmc_series-2.pdf; componentlink2description: DigiKey Link; componentlink2url: https://www.digikey.com/en/products/detail/cal-chip-electronics-inc/GMC10X7R105K50NT/18151141; Device Package: 0603 (1608 Metric); lastupdated: 12/17/2023 8:08:42 PM; Lifecycle Status: Active; Minimum Order: 1; Mounting Type: Surface Mount, MLCC; Operating Temperature: -55°C ~ 125°C; Package / Case: 0603 (1608 Metric); packaging: TapeAndReel; partid: 49828; Part Status: Active; price: 0.03; series: GMC; Size / Dimension: 0.063" L x 0.031" W (1.60mm x 0.80mm); Supplier 1: DigiKey; Supplier Part Number 1: 4713-GMC10X7R105K50NTCT-ND; Temperature Coefficient: X7R; Thickness (Max): 0.037" (0.95mm); Tolerance: ±10%; Voltage - Rated: 50V
C13 C14 = CGA3E2C0G1H080D080AA: CAP CER 8PF 50V C0G 0603; manufacturer: TDK Corporation; Temperature Coefficient: C0G, NP0; Tolerance: ±0.5pF; Part Number: CGA3E2C0G1H080D080AA; Value: 8 pF; Applications: Automotive; Capacitance: 8 pF; componentlink1description: Datasheet; componentlink1url: https://product.tdk.com/info/en/catalog/datasheets/mlcc_automotive_general_en.pdf?ref_disty=digikey; componentlink2description: DigiKey Link; componentlink2url: https://www.digikey.com/en/products/detail/tdk-corporation/CGA3E2C0G1H080D080AA/2443104; Device Package: 0603 (1608 Metric); lastupdated: 12/17/2023 8:09:16 PM; Lifecycle Status: Active; Minimum Order: 1; Mounting Type: Surface Mount, MLCC; Operating Temperature: -55°C ~ 125°C; Package / Case: 0603 (1608 Metric); packaging: TapeAndReel; partid: 15270; Part Status: Active; price: 0.01; Ratings: AEC-Q200; series: CGA; Size / Dimension: 0.063" L x 0.031" W (1.60mm x 0.80mm); Supplier 1: DigiKey; Supplier Part Number 1: 445-5626-1-ND; Thickness (Max): 0.035" (0.90mm); Voltage - Rated: 50V
IC1 = STM32F446VET6: IC MCU 32BIT 512KB FLASH 100LQFP; Manufacturer: STMicroelectronics; Connectivity: CANbus, EBI/EMI, I²C, IrDA, LINbus, SAI, SD, SPDIF-Rx, SPI, UART/USART, USB, USB OTG; Core Processor: ARM® Cortex®-M4; Core Size: 32-Bit; Data Converters: A/D 16x12b; D/A 2x12b; Number of I/O: 81; Oscillator Type: Internal; Peripherals: Brown-out Detect/Reset, DMA, I²S, LVD, POR, PWM, WDT; Program Memory Size: 512KB (512K x 8); RAM Size: 128K x 8; Speed: 180MHz; Voltage - Supply (Vcc/Vdd): 1.7V ~ 3.6V; Part Number: STM32F446VET6; ComponentLink1Description: Datasheet; ComponentLink1URL: http://www.st.com/content/ccc/resource/technical/document/datasheet/65/cb/75/50/53/d6/48/24/DM00141306.pdf/files/DM00141306.pdf/jcr:content/translations/en.DM00141306.pdf; ComponentLink2Description: DigiKey Link; ComponentLink2URL: //digikey.com/product-detail/en/stmicroelectronics/STM32F446VET6/497-15375-ND/5175961; Device Package: 100-LQFP; LastUpdated: 12/6/2019 1:21:46 AM; Lifecycle Status: 0; Minimum Order: 1; Mounting Type: Surface Mount; Operating Temperature: -40°C ~ 85°C (TA); Package / Case: 100-LQFP; Packaging: Tray; PartId: 128; Part Status: Active; Price: 8.21; Program Memory Type: FLASH; Series: STM32F4; Supplier 1: DigiKey; Supplier Part Number 1: 497-15375-ND; Supplier Device Package: 100-LQFP (14x14)
P1 = CMP-1502-00007-2: NexarPartId: 8917783; Number of Contacts: 10; Voltage Rating (DC): 250V; Insulation Resistance: 1GΩ; Current Rating: 3A; Row Spacing: 2.54mm; Contact Resistance: 20mΩ; Connector Type: Male Pin; Gender: Male; Flammability Rating: UL94 V-0; Termination: Solder; Width: 20.36mm; Length: 20.36mm; Housing Material: PBT; Operating Supply Voltage: 250V; Min Operating Temperature: -40°C; Lead Free: Lead Free; Insulation Material: PBT; Orientation: Vertical; RoHS: Compliant; Voltage Rating: 250V; Number of Pins: 10; Height: 8.85mm; REACH SVHC: Unknown; Contact Material: Copper; Contact Gender: Male; Color: Black; Mount: Through Hole; Contact Plating: Gold; Lead Pitch: 2.54mm; Number of Positions: 10; Pitch: 2.54mm; Max Operating Temperature: 105°C; Number of Rows: 2
R1 = RNCS0603BKE10K0: RES 10K OHM 0.1% 1/16W 0603; Manufacturer: Stackpole Electronics Inc; Power (Watts): 0.063W, 1/16W; Temperature Coefficient: ±25ppm/°C; Part Number: RNCS0603BKE10K0; Value: 10 kOhms; ComponentLink1Description: Datasheet; ComponentLink1URL: https://www.seielect.com/catalog/sei-rncs_rnch.pdf; ComponentLink2Description: DigiKey Link; ComponentLink2URL: https://www.digikey.com/en/products/detail/stackpole-electronics-inc/RNCS0603BKE10K0/1708836; Composition: Thin Film; Device Package: 0603 (1608 Metric); Features: Anti-Corrosive, Automotive AEC-Q200, Moisture Resistant; Height - Seated (Max): 0.022" (0.55mm); LastUpdated: 12/17/2023 8:41:13 PM; Lifecycle Status: Active; Minimum Order: 1; Number of Terminations: 2; Operating Temperature: -55°C ~ 155°C; Package / Case: 0603 (1608 Metric); Packaging: TapeAndReel; PartId: 4838; Part Status: Active; Price: 0.06; Ratings: AEC-Q200; Resistance: 10 kOhms; Series: RNCS; Size / Dimension: 0.061" L x 0.031" W (1.55mm x 0.80mm); Supplier 1: DigiKey; Supplier Part Number 1: RNCS0603BKE10K0CT-ND; Supplier Device Package: 0603; Tolerance: ±0.1%
S1 = KXT341 LHS: SWITCH TACTILE SPST-NO 0.02A 15V; Manufacturer: C&K; Actuator Height off PCB, Vertical: 0.60mm; Actuator Orientation: Top Actuated; Actuator Type: Standard; Contact Rating @ Voltage: 0.02A @ 15VDC; Illumination: Non-Illuminated; Operating Force: 330gf; Outline: 3.00mm x 2.00mm; Switch Function: Off-Mom; Part Number: KXT341 LHS; Circuit: SPST-NO; ComponentLink1Description: Datasheet; ComponentLink1URL: https://dznh3ojzb2azq.cloudfront.net/products/Tactile/KXT3/documents/datasheet.pdf; ComponentLink2Description: DigiKey Link; ComponentLink2URL: https://www.digikey.com/en/products/detail/c-k/KXT341-LHS/6607322; LastUpdated: 12/17/2023 9:51:39 PM; Lifecycle Status: Active; Minimum Order: 1; Mounting Type: Surface Mount; Operating Temperature: -40°C ~ 85°C; Packaging: TapeAndReel; Part Status: Active; Price: 0.13; Series: KXT3; Supplier 1: DigiKey; Supplier Part Number 1: CKN10781CT-ND; Termination Style: SMD (SMT) Tab
U?#1 = CMP-0395-00503-2: Single Output LDO, 1 A, Fixed 3.3 V Output, 2 to 5.5 V Input, 4-pin SOT-223 (DCY), -40 to 125 degC, Green (RoHS & no Sb/Br); Manufacturer: Texas Instruments; Vout Adj(Min)(V): 3.3; Vdo(Typ)(mV): 1200; Iq(Typ)(mA): 0.05; Accuracy(%): 2; Iout(Max)(A): 1; SubFamily: Single Channel LDO; Vin(Max)(V): 5.5; PackageReference: DCY0004A; PackageDescription: 4-Pin Plastic Small Outline, Body 3.5 x 6.5 mm, Pitch 2.3 mm; Vout Adj(Max)(V): 3.3; Mounting Technology: Surface Mount; ComponentLink2Description: Datasheet; ComponentLink1Description: Manufacturer URL; PartNumber: TLV1117LV33DCYR; ComponentLink3Description: Package Specification; ComponentLink1URL: http://www.ti.com/; ComponentLink2URL: http://www.ti.com/general/docs/lit/getliterature.tsp?genericPartNumber=TLV1117LV33&fileType=pdf; Fixed Output Options(V): 3.3; PackageVersion: 4202506/B; Vin(Min)(V): 2; DatasheetVersion: SBVS160A; Eco-Plan: Green (RoHS & no Sb/Br); ComponentLink3URL: http://www.ti.com/litv/pdf/mpds094a; Code_JEDEC: TO-261
Y1 = ABLS-8.000MHZ-B-4-Y-T: CRYSTAL 8.0000MHZ 18PF SMD; Manufacturer: Abracon LLC; ESR (Equivalent Series Resistance): 80 Ohms; Frequency Stability: ±30ppm; Operating Mode: Fundamental; Part Number: ABLS-8.000MHZ-B-4-Y-T; ComponentLink1Description: Datasheet; ComponentLink1URL: https://abracon.com/Resonators/abls.pdf; ComponentLink2Description: DigiKey Link; ComponentLink2URL: https://www.digikey.com/en/products/detail/abracon-llc/ABLS-8-000MHZ-B-4-Y-T/9997854; Frequency: 8 MHz; Frequency Tolerance: ±30ppm; Height - Seated (Max): 0.165" (4.20mm); LastUpdated: 12/16/2023 9:32:42 PM; Lifecycle Status: Active; Load Capacitance: 18pF; Minimum Order: 1; Mounting Type: Surface Mount; Operating Temperature: -20°C ~ 70°C; Package / Case: HC-49/US; Packaging: TapeAndReel; PartId: 61; Part Status: Active; Price: 0.10; Series: ABLS; Size / Dimension: 0.449" L x 0.185" W (11.40mm x 4.70mm); Supplier 1: DigiKey; Supplier Part Number 1: 535-14946-1-ND; Type: MHz Crystal; Value: 8 MHz

## Sheet CAN.SchDoc
size A4; SheetNumber: 3; SheetTotal: 7
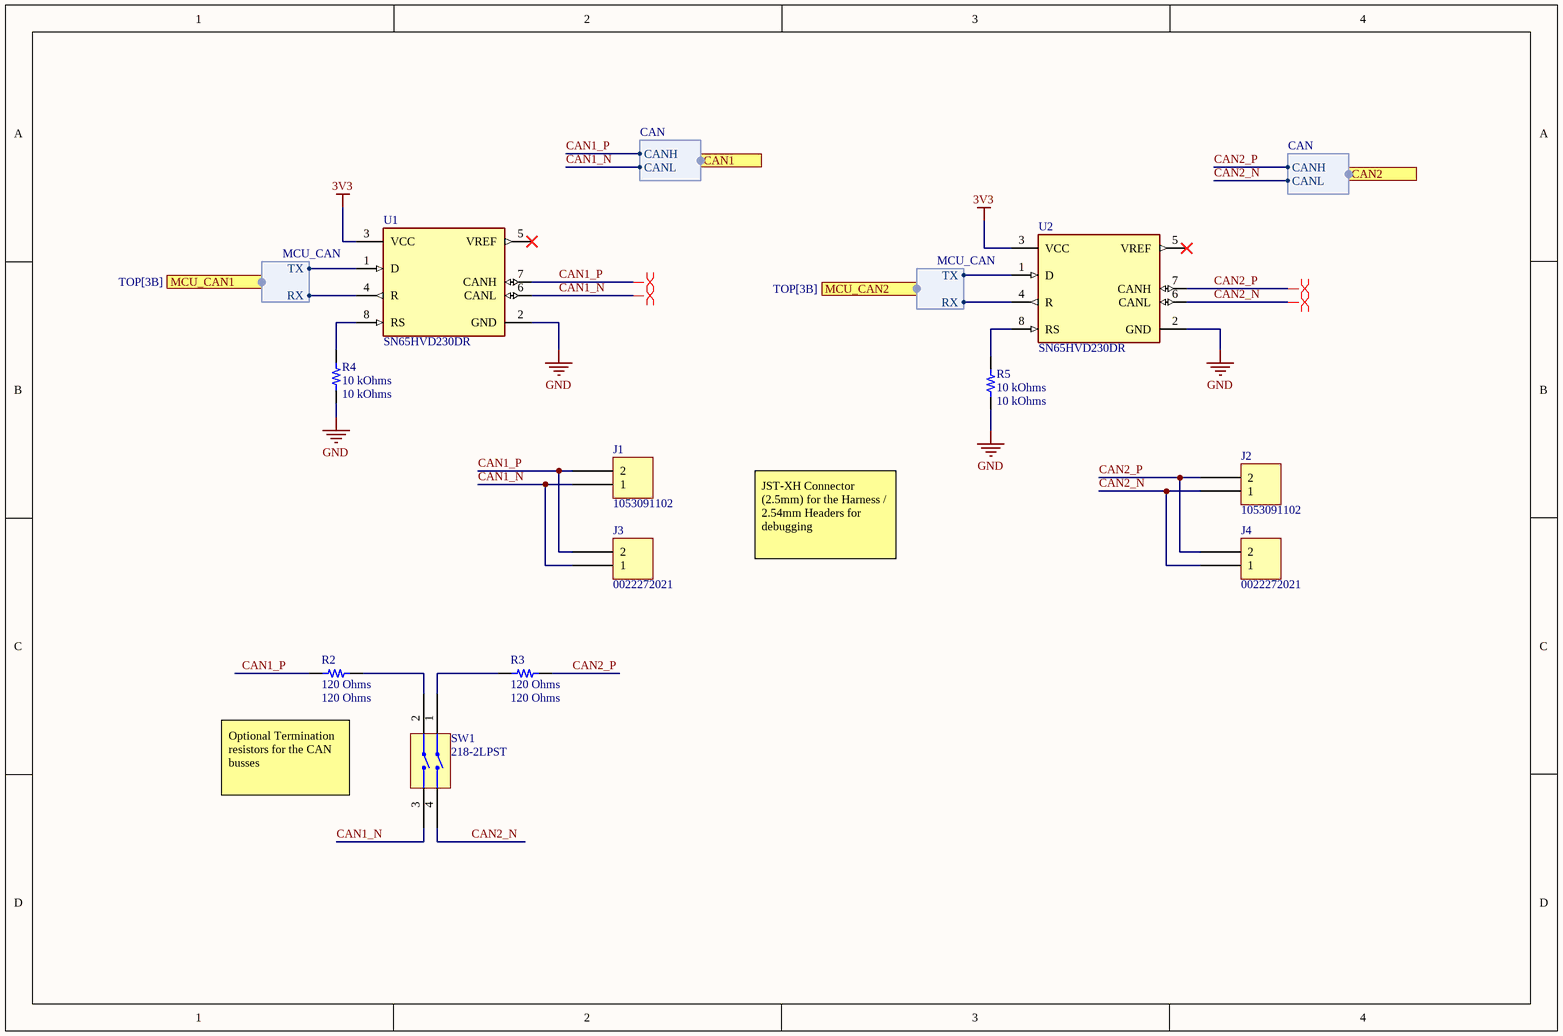
[diagram p2: CAN.SchDoc]

### Parts
J1  1053091102  [MOLEX 1053091102]
J2  1053091102  [MOLEX 1053091102]
J3  0022272021  [MOLEX KK 0022272021]
J4  0022272021  [MOLEX KK 0022272021]
R2  120 Ohms  [RES 0603_1608]
R3  120 Ohms  [RES 0603_1608]
R4  10 kOhms  [RES 0603_1608]
R5  10 kOhms  [RES 0603_1608]
SW1  218-2LPST  [CTS 218-2LPJ]
U1  SN65HVD230DR  [FP-D0008A-IPC_A]
U2  SN65HVD230DR  [FP-D0008A-IPC_A]

### Ports
CAN1 (harness CAN), CAN2 (harness CAN), MCU_CAN1 (harness MCU_CAN, see TOP[3B]), MCU_CAN2 (harness MCU_CAN, see TOP[3B])

### Harnesses
MCU_CAN: RX, TX
CAN: CANH, CANL

### Nets
3V3: U1.3(VCC) U2.3(VCC)
GND: R4.1 R5.1 U1.2(GND) U2.2(GND)
CAN1_N: J1.1 J3.1 SW1.3(GND) U1.6(CANL) ; port CAN1.CANL  [project net CAN1.CANL]
CAN1_P: J1.2 J3.2 R2.1 U1.7(CANH) ; port CAN1.CANH  [project net CAN1.CANH]
CAN2_N: J2.1 J4.1 SW1.4(GND) U2.6(CANL) ; port CAN2.CANL  [project net CAN2.CANL]
CAN2_P: J2.2 J4.2 R3.2 U2.7(CANH) ; port CAN2.CANH  [project net CAN2.CANH]
NetIC1_70: U1.4(R) ; port MCU_CAN1.RX
NetIC1_71: U1.1(D) ; port MCU_CAN1.TX
NetIC1_91: U2.4(R) ; port MCU_CAN2.RX
NetIC1_92: U2.1(D) ; port MCU_CAN2.TX
NetR2_2: R2.2 SW1.2(GND)
NetR3_1: R3.1 SW1.1(GND)
NetR4_2: R4.2 U1.8(RS)
NetR5_2: R5.2 U2.8(RS)

Not connected (* = marked no-connect by the designer): U1 5(VREF)*; U2 5(VREF)*

### Layout directives
differential pair: CAN1.CANH, CAN1.CANL, CAN2.CANH, CAN2.CANL

### Notes on the sheet
- JST-XH Connector (2.5mm) for the Harness / 2.54mm Headers for debugging
- Optional Termination resistors for the CAN busses

### Library data of the parts
J1 J2 = 1053091102: CONN HEADER VERT 2POS 2.5MM; Part Number: 1053091102
J3 J4 = 0022272021: CONN HEADER VERT 2POS 2.54MM; Part Number: 0022272021
R2 R3 = ERA-3AEB121V: RES SMD 120 OHM 0.1% 1/10W 0603; Part Number: ERA-3AEB121V; Value: 120 Ohms
R4 R5 = AA0603FR-0710KL: RES SMD 10K OHM 1% 1/10W 0603; Part Number: AA0603FR-0710KL; Value: 10 kOhms
SW1 = 218-2LPST: SWITCH SLIDE DIP SPST 25MA 24V; Part Number: 218-2LPST
U1 U2 = CMP-0315-00015-3: IC TRANSCEIVER HALF 1/1 8SOIC; Number of Transceivers: 1; Operating Supply Voltage: 3.3V; Number of I/Os: 2; Max Supply Current: 17mA; Max Supply Voltage: 3.6V; Min Supply Voltage: 3V; Data Rate: 1Mbps; Min Operating Temperature: -40°C; Packaging: Tape and Reel; Lead Free: Lead Free; Number of Transmit Buffers: 1; Max Operating Temperature: 85°C; Number of Receive Buffers: 1; Number of Pins: 8; Package Quantity: 1; Radiation Hardening: No; Case/Package: D; REACH SVHC: No SVHC; Weight: 0.002561oz; Termination: SMD/SMT; Contact Plating: Gold; Nominal Supply Current: 17mA; Number of Receivers: 1; Number of Drivers: 1

## Sheet IO.SchDoc
size A3; SheetNumber: 4; SheetTotal: 14
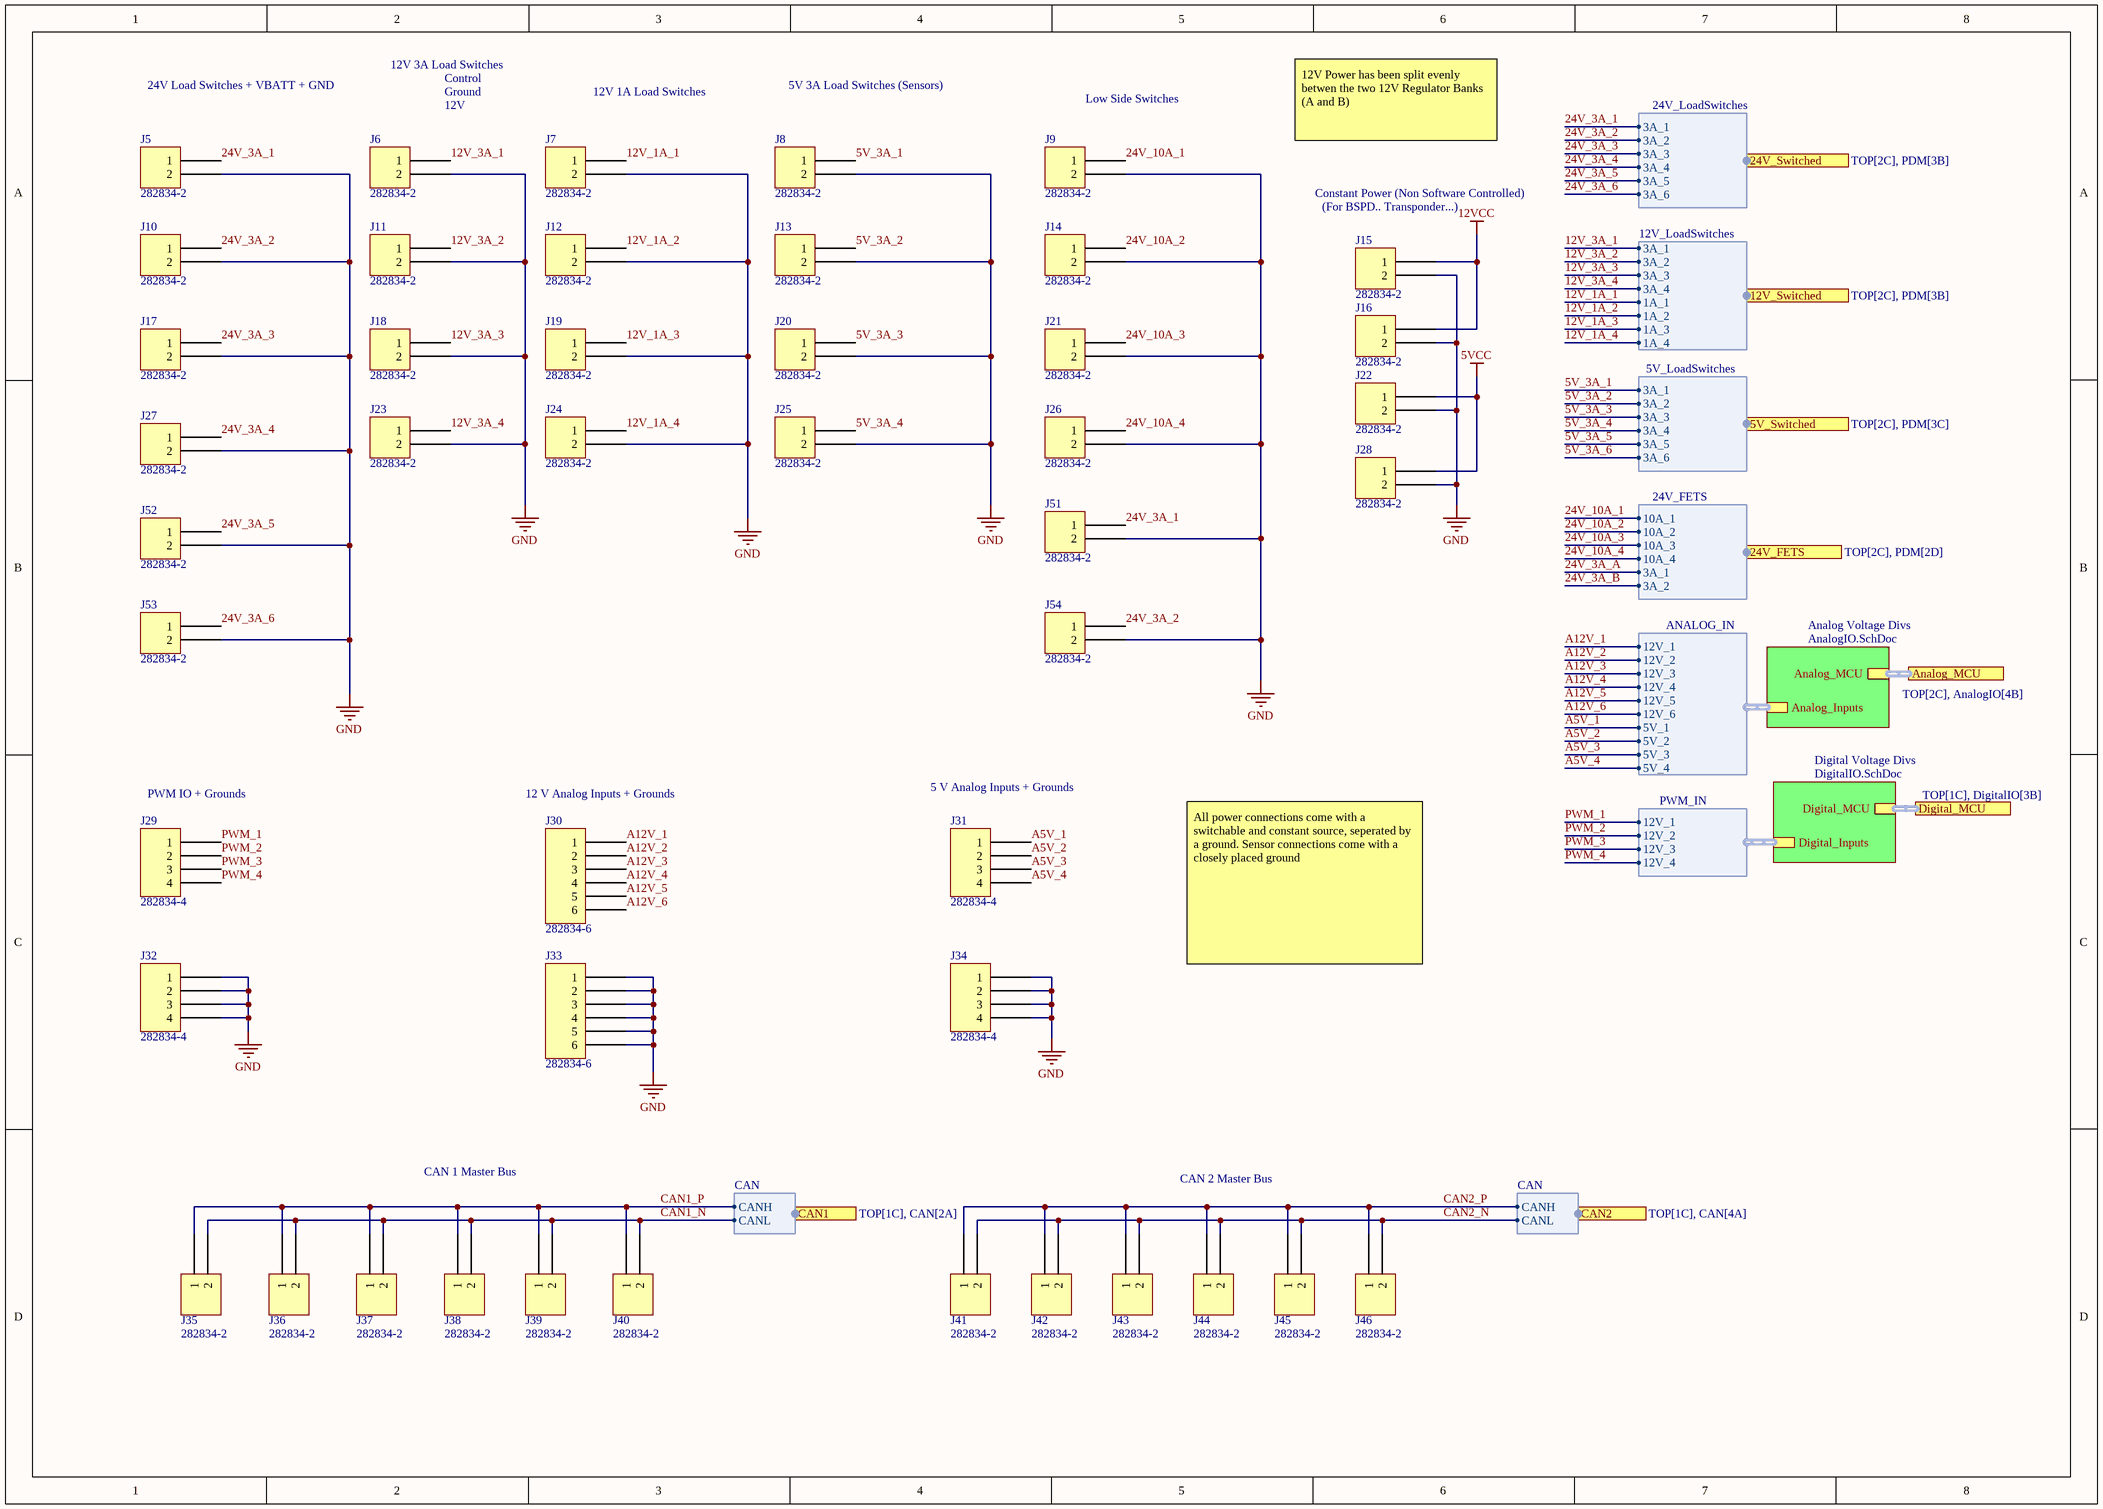
[diagram p3: IO.SchDoc]

### Parts
J5  282834-2  [TE 282834-2]
J6  282834-2  [TE 282834-2]
J7  282834-2  [TE 282834-2]
J8  282834-2  [TE 282834-2]
J9  282834-2  [TE 282834-2]
J10  282834-2  [TE 282834-2]
J11  282834-2  [TE 282834-2]
J12  282834-2  [TE 282834-2]
J13  282834-2  [TE 282834-2]
J14  282834-2  [TE 282834-2]
J15  282834-2  [TE 282834-2]
J16  282834-2  [TE 282834-2]
J17  282834-2  [TE 282834-2]
J18  282834-2  [TE 282834-2]
J19  282834-2  [TE 282834-2]
J20  282834-2  [TE 282834-2]
J21  282834-2  [TE 282834-2]
J22  282834-2  [TE 282834-2]
J23  282834-2  [TE 282834-2]
J24  282834-2  [TE 282834-2]
J25  282834-2  [TE 282834-2]
J26  282834-2  [TE 282834-2]
J27  282834-2  [TE 282834-2]
J28  282834-2  [TE 282834-2]
J29  282834-4  [TE 282834-4]
J30  282834-6  [TE 282834-6]
J31  282834-4  [TE 282834-4]
J32  282834-4  [TE 282834-4]
J33  282834-6  [TE 282834-6]
J34  282834-4  [TE 282834-4]
J35  282834-2  [TE 282834-2]
J36  282834-2  [TE 282834-2]
J37  282834-2  [TE 282834-2]
J38  282834-2  [TE 282834-2]
J39  282834-2  [TE 282834-2]
J40  282834-2  [TE 282834-2]
J41  282834-2  [TE 282834-2]
J42  282834-2  [TE 282834-2]
J43  282834-2  [TE 282834-2]
J44  282834-2  [TE 282834-2]
J45  282834-2  [TE 282834-2]
J46  282834-2  [TE 282834-2]
J51  282834-2  [TE 282834-2]
J52  282834-2  [TE 282834-2]
J53  282834-2  [TE 282834-2]
J54  282834-2  [TE 282834-2]

### Sub-sheets
Analog Voltage Divs = AnalogIO.SchDoc: Analog_Inputs (harness ANALOG_IN), Analog_MCU (harness ANALOG_IN)
Digital Voltage Divs = DigitalIO.SchDoc (file not in this document): Digital_Inputs (harness PWM_IN), Digital_MCU (harness PWM_IN)

### Ports
5V_Switched (harness 5V_LoadSwitches, see TOP[2C], PDM[3C]), 12V_Switched (harness 12V_LoadSwitches, see TOP[2C], PDM[3B]), 24V_FETS (harness 24V_FETS, see TOP[2C], PDM[2D]), 24V_Switched (harness 24V_LoadSwitches, see TOP[2C], PDM[3B]), Analog_MCU (harness ANALOG_IN, see TOP[2C], AnalogIO[4B]), CAN1 (harness CAN, see TOP[1C], CAN[2A]), CAN2 (harness CAN, see TOP[1C], CAN[4A]), Digital_MCU (harness PWM_IN, see TOP[1C], DigitalIO[3B])

### Harnesses
24V_LoadSwitches: 3A_1, 3A_2, 3A_3, 3A_4, 3A_5, 3A_6
12V_LoadSwitches: 3A_1, 3A_2, 3A_3, 3A_4, 1A_1, 1A_2, 1A_3, 1A_4
5V_LoadSwitches: 3A_1, 3A_2, 3A_3, 3A_4, 3A_5, 3A_6
24V_FETS: 10A_1, 10A_2, 10A_3, 10A_4, 3A_1, 3A_2
ANALOG_IN: 12V_1, 12V_2, 12V_3, 12V_4, 12V_5, 12V_6, 5V_1, 5V_2, 5V_3, 5V_4
PWM_IN: 12V_1, 12V_2, 12V_3, 12V_4
CAN: CANH, CANL

### Nets
5VCC: J22.1 J28.1
12VCC: J15.1 J16.1
GND: J5.2 J6.2 J7.2 J8.2 J9.2 J10.2 J11.2 J12.2 J13.2 J14.2 J15.2 J16.2 J17.2 J18.2 J19.2 J20.2 J21.2 J22.2 J23.2 J24.2 J25.2 J26.2 J27.2 J28.2 J32.1 J32.2 J32.3 J32.4 J33.1 J33.2 J33.3 J33.4 J33.5 J33.6 J34.1 J34.2 J34.3 J34.4 J51.2 J52.2 J53.2 J54.2
5V_3A_1: J8.1 ; port 5V_Switched.3A_1
5V_3A_2: J13.1 ; port 5V_Switched.3A_2
5V_3A_3: J20.1 ; port 5V_Switched.3A_3
5V_3A_4: J25.1 ; port 5V_Switched.3A_4
5V_3A_5: port 5V_Switched.3A_5
5V_3A_6: port 5V_Switched.3A_6
12V_1A_1: J7.1 ; port 12V_Switched.1A_1
12V_1A_2: J12.1 ; port 12V_Switched.1A_2
12V_1A_3: J19.1 ; port 12V_Switched.1A_3
12V_1A_4: J24.1 ; port 12V_Switched.1A_4
12V_3A_1: J6.1 ; port 12V_Switched.3A_1
12V_3A_2: J11.1 ; port 12V_Switched.3A_2
12V_3A_3: J18.1 ; port 12V_Switched.3A_3
12V_3A_4: J23.1 ; port 12V_Switched.3A_4
24V_3A_1: J5.1 J51.1 ; port 24V_Switched.3A_1
24V_3A_2: J10.1 J54.1 ; port 24V_Switched.3A_2
24V_3A_3: J17.1 ; port 24V_Switched.3A_3
24V_3A_4: J27.1 ; port 24V_Switched.3A_4
24V_3A_5: J52.1 ; port 24V_Switched.3A_5
24V_3A_6: J53.1 ; port 24V_Switched.3A_6
24V_3A_A: port 24V_FETS.3A_1
24V_3A_B: port 24V_FETS.3A_2
24V_10A_1: J9.1 ; port 24V_FETS.10A_1
24V_10A_2: J14.1 ; port 24V_FETS.10A_2
24V_10A_3: J21.1 ; port 24V_FETS.10A_3
24V_10A_4: J26.1 ; port 24V_FETS.10A_4
A5V_1: J31.1 ; sheet Analog Voltage Divs/Analog_Inputs.5V_1
A5V_2: J31.2 ; sheet Analog Voltage Divs/Analog_Inputs.5V_2
A5V_3: J31.3 ; sheet Analog Voltage Divs/Analog_Inputs.5V_3
A5V_4: J31.4 ; sheet Analog Voltage Divs/Analog_Inputs.5V_4
A12V_1: J30.1 ; sheet Analog Voltage Divs/Analog_Inputs.12V_1
A12V_2: J30.2 ; sheet Analog Voltage Divs/Analog_Inputs.12V_2
A12V_3: J30.3 ; sheet Analog Voltage Divs/Analog_Inputs.12V_3
A12V_4: J30.4 ; sheet Analog Voltage Divs/Analog_Inputs.12V_4
A12V_5: J30.5 ; sheet Analog Voltage Divs/Analog_Inputs.12V_5
A12V_6: J30.6 ; sheet Analog Voltage Divs/Analog_Inputs.12V_6
CAN1_N: J35.2 J36.2 J37.2 J38.2 J39.2 J40.2 ; port CAN1.CANL  [project net CAN1.CANL]
CAN1_P: J35.1 J36.1 J37.1 J38.1 J39.1 J40.1 ; port CAN1.CANH  [project net CAN1.CANH]
CAN2_N: J41.2 J42.2 J43.2 J44.2 J45.2 J46.2 ; port CAN2.CANL  [project net CAN2.CANL]
CAN2_P: J41.1 J42.1 J43.1 J44.1 J45.1 J46.1 ; port CAN2.CANH  [project net CAN2.CANH]
PWM_1: J29.1 ; sheet Digital Voltage Divs/Digital_Inputs.12V_1
PWM_2: J29.2 ; sheet Digital Voltage Divs/Digital_Inputs.12V_2
PWM_3: J29.3 ; sheet Digital Voltage Divs/Digital_Inputs.12V_3
PWM_4: J29.4 ; sheet Digital Voltage Divs/Digital_Inputs.12V_4

### Buses and harness runs
harness port Analog_MCU = sheet Analog Voltage Divs/Analog_MCU
harness port Digital_MCU = sheet Digital Voltage Divs/Digital_MCU

### Notes on the sheet
- 24V Load Switches + VBATT + GND
- 12V 3A Load Switches
- Control
- Ground
- 12V
- 12V 1A Load Switches
- 5V 3A Load Switches (Sensors)
- Low Side Switches
- 12V Power has been split evenly betwen the two 12V Regulator Banks (A and B)
- Constant Power (Non Software Controlled)
- (near J15) (For BSPD.. Transponder...)
- (near J29) PWM IO + Grounds
- (near J30) 12 V Analog Inputs + Grounds
- (near J31) 5 V Analog Inputs + Grounds
- All power connections come with a switchable and constant source, seperated by a ground. Sensor connections come with a closely placed ground
- CAN 1 Master Bus
- CAN 2 Master Bus

### Library data of the parts
J5-J28 J35-J46 J51-J54 = 282834-2: TERM BLK 2P SIDE ENT 2.54MM PCB; Part Number: 282834-2
J29 J31 J32 J34 = 282834-4: TERM BLK 4P SIDE ENT 2.54MM PCB; Part Number: 282834-4
J30 J33 = 282834-6: TERM BLK 6P SIDE ENT 2.54MM PCB; Part Number: 282834-6

## Sheet AnalogIO.SchDoc
size A4; SheetNumber: 5; SheetTotal: 10
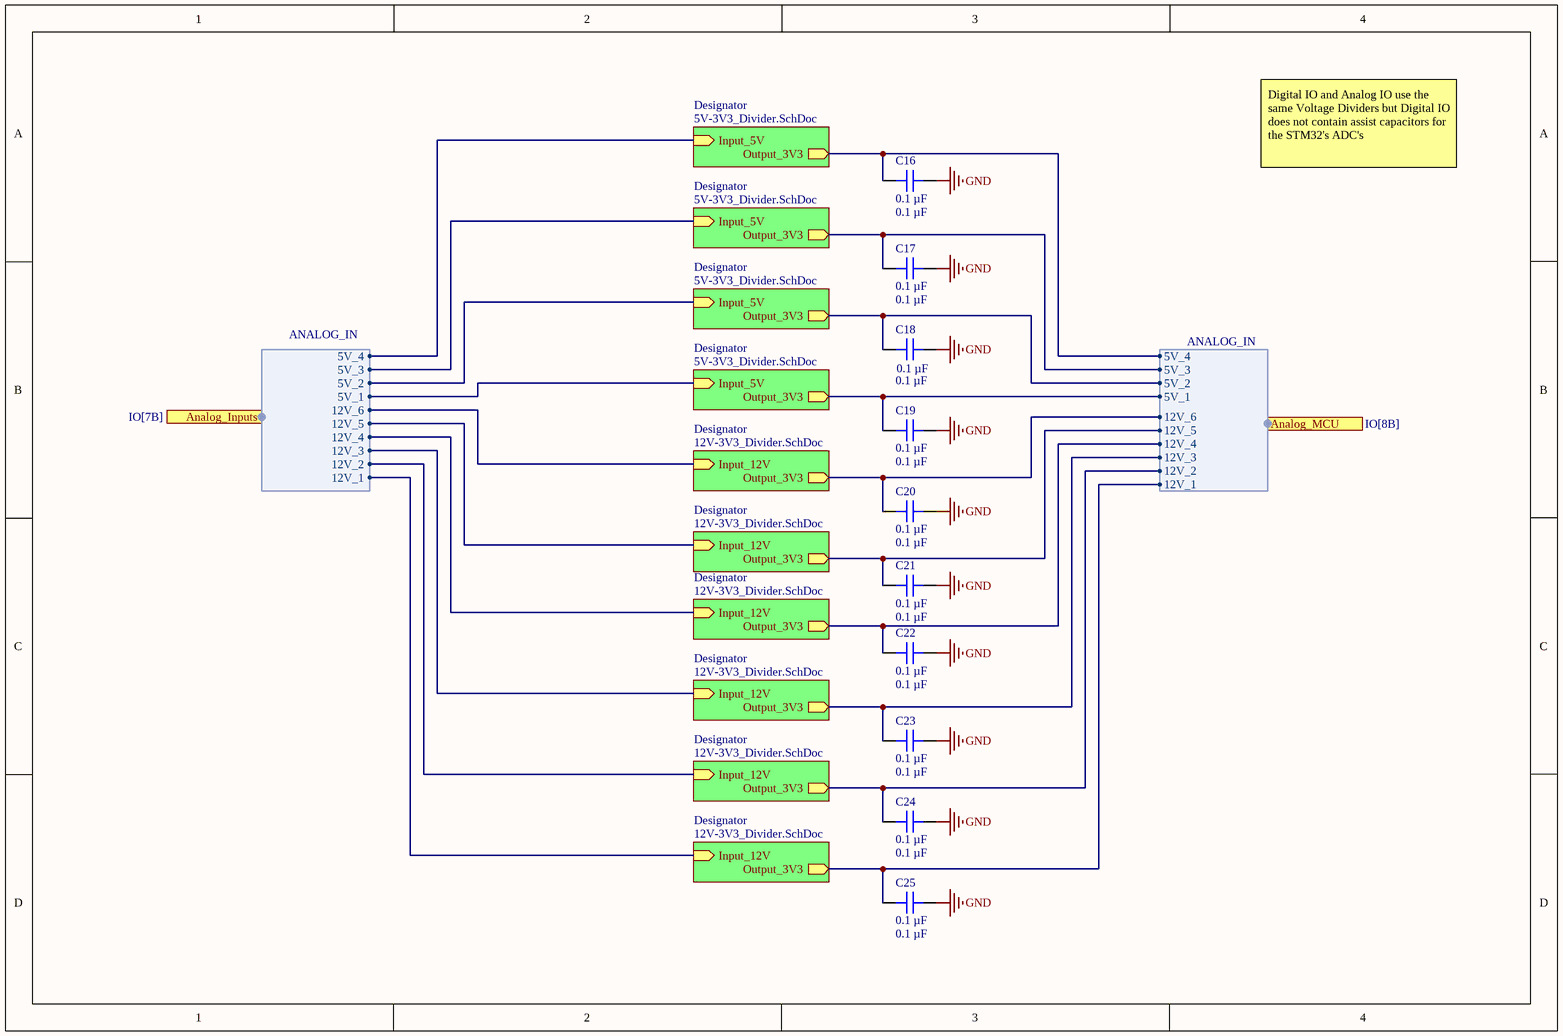
[diagram p4: AnalogIO.SchDoc]

### Parts
C16  0.1 µF  [CAP 0603_1608]
C17  0.1 µF  [CAP 0603_1608]
C18  0.1 µF  [CAP 0603_1608]
C19  0.1 µF  [CAP 0603_1608]
C20  0.1 µF  [CAP 0603_1608]
C21  0.1 µF  [CAP 0603_1608]
C22  0.1 µF  [CAP 0603_1608]
C23  0.1 µF  [CAP 0603_1608]
C24  0.1 µF  [CAP 0603_1608]
C25  0.1 µF  [CAP 0603_1608]

### Sub-sheets
Designator = 12V-3V3_Divider.SchDoc: Input_12V (in), Output_3V3 (out)
Designator = 12V-3V3_Divider.SchDoc: Input_12V (in), Output_3V3 (out)
Designator = 12V-3V3_Divider.SchDoc: Input_12V (in), Output_3V3 (out)
Designator = 12V-3V3_Divider.SchDoc: Input_12V (in), Output_3V3 (out)
Designator = 12V-3V3_Divider.SchDoc: Input_12V (in), Output_3V3 (out)
Designator = 12V-3V3_Divider.SchDoc: Input_12V (in), Output_3V3 (out)
Designator = 5V-3V3_Divider.SchDoc: Input_5V (in), Output_3V3 (out)
Designator = 5V-3V3_Divider.SchDoc: Input_5V (in), Output_3V3 (out)
Designator = 5V-3V3_Divider.SchDoc: Input_5V (in), Output_3V3 (out)
Designator = 5V-3V3_Divider.SchDoc: Input_5V (in), Output_3V3 (out)

### Ports
Analog_Inputs (harness ANALOG_IN, see IO[7B]), Analog_MCU (harness ANALOG_IN, see IO[8B])

### Harnesses
ANALOG_IN: 12V_1, 12V_2, 12V_3, 12V_4, 12V_5, 12V_6, 5V_1, 5V_2, 5V_3, 5V_4

### Nets
GND: C16.2 C17.2 C18.2 C19.2 C20.2 C21.2 C22.2 C23.2 C24.2 C25.2
A5V_1: sheet Designator/Input_5V, port Analog_Inputs.5V_1
A5V_2: sheet Designator/Input_5V, port Analog_Inputs.5V_2
A5V_3: sheet Designator/Input_5V, port Analog_Inputs.5V_3
A5V_4: sheet Designator/Input_5V, port Analog_Inputs.5V_4
A12V_1: sheet Designator/Input_12V, port Analog_Inputs.12V_1
A12V_2: sheet Designator/Input_12V, port Analog_Inputs.12V_2
A12V_3: sheet Designator/Input_12V, port Analog_Inputs.12V_3
A12V_4: sheet Designator/Input_12V, port Analog_Inputs.12V_4
A12V_5: sheet Designator/Input_12V, port Analog_Inputs.12V_5
A12V_6: sheet Designator/Input_12V, port Analog_Inputs.12V_6
ADC_IN6: C16.1 ; sheet Designator/Output_3V3, port Analog_MCU.5V_4
ADC_IN7: C17.1 ; sheet Designator/Output_3V3, port Analog_MCU.5V_3
ADC_IN8: C18.1 ; sheet Designator/Output_3V3, port Analog_MCU.5V_2
ADC_IN9: C19.1 ; sheet Designator/Output_3V3, port Analog_MCU.5V_1
ADC_IN10: C20.1 ; sheet Designator/Output_3V3, port Analog_MCU.12V_6
ADC_IN11: C21.1 ; sheet Designator/Output_3V3, port Analog_MCU.12V_5
ADC_IN12: C22.1 ; sheet Designator/Output_3V3, port Analog_MCU.12V_4
ADC_IN13: C23.1 ; sheet Designator/Output_3V3, port Analog_MCU.12V_3
ADC_IN14: C24.1 ; sheet Designator/Output_3V3, port Analog_MCU.12V_2
ADC_IN15: C25.1 ; sheet Designator/Output_3V3, port Analog_MCU.12V_1

### Notes on the sheet
- Digital IO and Analog IO use the same Voltage Dividers but Digital IO does not contain assist capacitors for the STM32's ADC's

### Library data of the parts
C16-C25 = CS0603KRX7R7BB104: CAP CER 0.1UF 16V X7R 0603; Part Number: CS0603KRX7R7BB104; Value: 0.1 µF

## Sheet 12V-3V3_Divider.SchDoc
size A4; SheetNumber: 6; SheetTotal: 10
Used 6 times, as channels Ports/Analog Voltage Divs/Designator, Ports/Analog Voltage Divs/Designator, Ports/Analog Voltage Divs/Designator, Ports/Analog Voltage Divs/Designator, Ports/Analog Voltage Divs/Designator, Ports/Analog Voltage Divs/Designator. Parts and nets are listed once, with the designators drawn on the sheet.
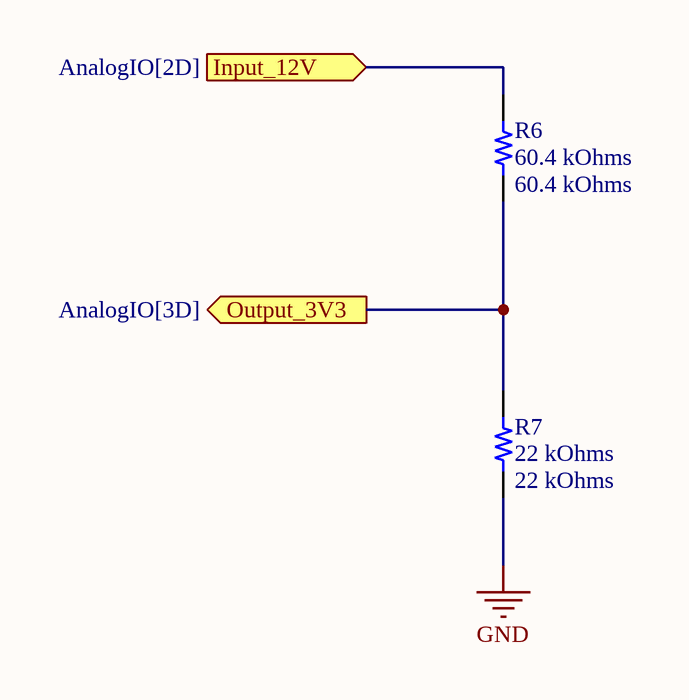
[diagram p5: 12V-3V3_Divider.SchDoc]

### Parts
R6  60.4 kOhms  [RES 0603_1608]
R7  22 kOhms  [RES 0603_1608]

### Ports
Input_12V (in, see AnalogIO[2D]), Output_3V3 (out, see AnalogIO[3D])

### Nets
GND: R7.1
Input_12V: R6.2 ; port Input_12V
Output_3V3: R6.1 R7.2 ; port Output_3V3

### Channels
Ports/Analog Voltage Divs/Designator: designators end in _Ports_Analog_Voltage_Divs_Designator#1; ports Input_12V=A12V_6 Output_3V3=ADC_IN10
Ports/Analog Voltage Divs/Designator: designators end in _Ports_Analog_Voltage_Divs_Designator#2; ports Input_12V=A12V_1 Output_3V3=ADC_IN15
Ports/Analog Voltage Divs/Designator: designators end in _Ports_Analog_Voltage_Divs_Designator#3; ports Input_12V=A12V_2 Output_3V3=ADC_IN14
Ports/Analog Voltage Divs/Designator: designators end in _Ports_Analog_Voltage_Divs_Designator#4; ports Input_12V=A12V_3 Output_3V3=ADC_IN13
Ports/Analog Voltage Divs/Designator: designators end in _Ports_Analog_Voltage_Divs_Designator#5; ports Input_12V=A12V_4 Output_3V3=ADC_IN12
Ports/Analog Voltage Divs/Designator: designators end in _Ports_Analog_Voltage_Divs_Designator#6; ports Input_12V=A12V_5 Output_3V3=ADC_IN11

### Library data of the parts
R6 = AC0603FR-0760K4L: RES SMD 60.4K OHM 1% 1/10W 0603; Part Number: AC0603FR-0760K4L; Value: 60.4 kOhms
R7 = AC0603FR-7W22KL: RES 22K OHM 1% 1/5W 0603; Part Number: AC0603FR-7W22KL; Value: 22 kOhms

## Sheet 5V-3V3_Divider.SchDoc
size A4; SheetNumber: 7; SheetTotal: 10
Used 4 times, as channels Ports/Analog Voltage Divs/Designator, Ports/Analog Voltage Divs/Designator, Ports/Analog Voltage Divs/Designator, Ports/Analog Voltage Divs/Designator. Parts and nets are listed once, with the designators drawn on the sheet.
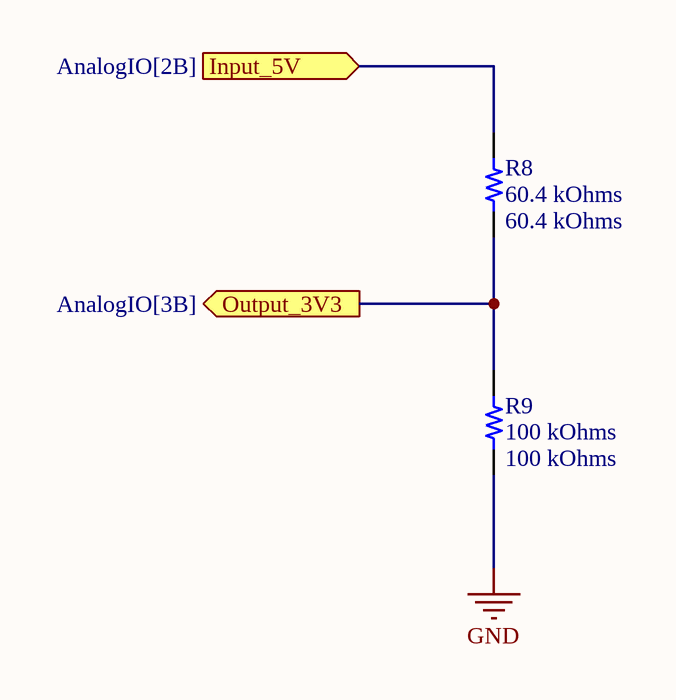
[diagram p6: 5V-3V3_Divider.SchDoc]

### Parts
R8  60.4 kOhms  [RES 0603_1608]
R9  100 kOhms  [RES 0603_1608]

### Ports
Input_5V (in, see AnalogIO[2B]), Output_3V3 (out, see AnalogIO[3B])

### Nets
GND: R9.1
Input_5V: R8.2 ; port Input_5V
Output_3V3: R8.1 R9.2 ; port Output_3V3

### Channels
Ports/Analog Voltage Divs/Designator: designators end in _Ports_Analog_Voltage_Divs_Designator#1; ports Input_5V=A5V_1 Output_3V3=ADC_IN9
Ports/Analog Voltage Divs/Designator: designators end in _Ports_Analog_Voltage_Divs_Designator#2; ports Input_5V=A5V_2 Output_3V3=ADC_IN8
Ports/Analog Voltage Divs/Designator: designators end in _Ports_Analog_Voltage_Divs_Designator#3; ports Input_5V=A5V_3 Output_3V3=ADC_IN7
Ports/Analog Voltage Divs/Designator: designators end in _Ports_Analog_Voltage_Divs_Designator#4; ports Input_5V=A5V_4 Output_3V3=ADC_IN6

### Library data of the parts
R8 = AC0603FR-0760K4L: RES SMD 60.4K OHM 1% 1/10W 0603; Part Number: AC0603FR-0760K4L; Value: 60.4 kOhms
R9 = AA0603FR-07100KL: RES SMD 100K OHM 1% 1/10W 0603; Part Number: AA0603FR-07100KL; Value: 100 kOhms

## Sheet PDM.SchDoc
size A4; SheetNumber: 9; SheetTotal: 14
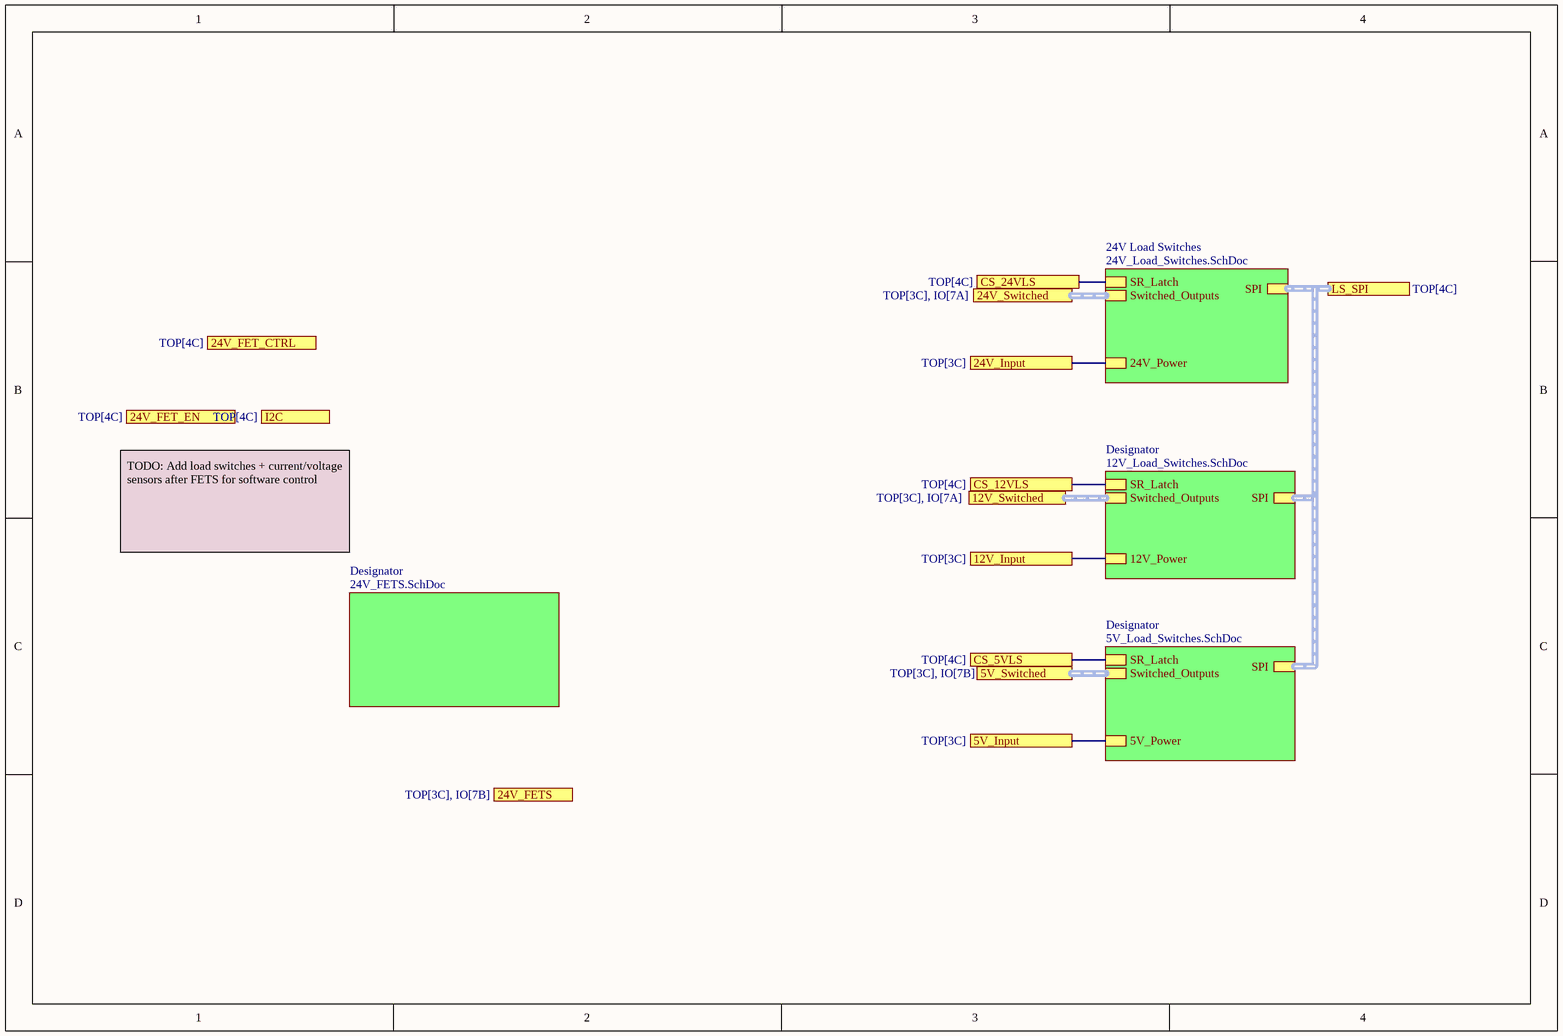
[diagram p7: PDM.SchDoc]

### Sub-sheets
24V Load Switches = 24V_Load_Switches.SchDoc: 24V_Power, SR_Latch, SPI (harness SPI), Switched_Outputs (harness 24V_LoadSwitches)
Designator = 12V_Load_Switches.SchDoc: Switched_Outputs (harness 12V_LoadSwitches), 12V_Power, SR_Latch, SPI (harness SPI)
Designator = 5V_Load_Switches.SchDoc: 5V_Power, Switched_Outputs (harness 5V_LoadSwitches), SR_Latch, SPI (harness SPI)
Designator = 24V_FETS.SchDoc: no entries

### Ports
5V_Input (see TOP[3C]), 5V_Switched (harness 5V_LoadSwitches, see TOP[3C], IO[7B]), 12V_Input (see TOP[3C]), 12V_Switched (harness 12V_LoadSwitches, see TOP[3C], IO[7A]), 24V_FET_CTRL (harness 24V_FETS, see TOP[4C]), 24V_FET_EN (harness 24V_FETS, see TOP[4C]), 24V_FETS (harness 24V_FETS, see TOP[3C], IO[7B]), 24V_Input (see TOP[3C]), 24V_Switched (harness 24V_LoadSwitches, see TOP[3C], IO[7A]), CS_5VLS (see TOP[4C]), CS_12VLS (see TOP[4C]), CS_24VLS (see TOP[4C]), I2C (harness I2C, see TOP[4C]), LS_SPI (harness SPI, see TOP[4C])

### Nets
NetIC1_81: port CS_24VLS, sheet 24V Load Switches/SR_Latch
NetIC1_82: port CS_12VLS, sheet Designator/SR_Latch
NetIC1_83: port CS_5VLS, sheet Designator/SR_Latch
NetR24_1: port 24V_Input, sheet 24V Load Switches/24V_Power
NetR26_1: port 12V_Input, sheet Designator/12V_Power
NetR28_1: port 5V_Input, sheet Designator/5V_Power

### Buses and harness runs
harness port 5V_Switched = sheet Designator/Switched_Outputs
harness port 12V_Switched = sheet Designator/Switched_Outputs
harness port 24V_Switched = sheet 24V Load Switches/Switched_Outputs
harness port LS_SPI = sheet 24V Load Switches/SPI = sheet Designator/SPI

### Notes on the sheet
- TODO: Add load switches + current/voltage sensors after FETS for software control